# EAGLE design nucleum (EAGLE 6.6.0)
AUTHOR: Joshua Adkins; REV: A; TITLE: Nucleum

## Sheet 1 of 5
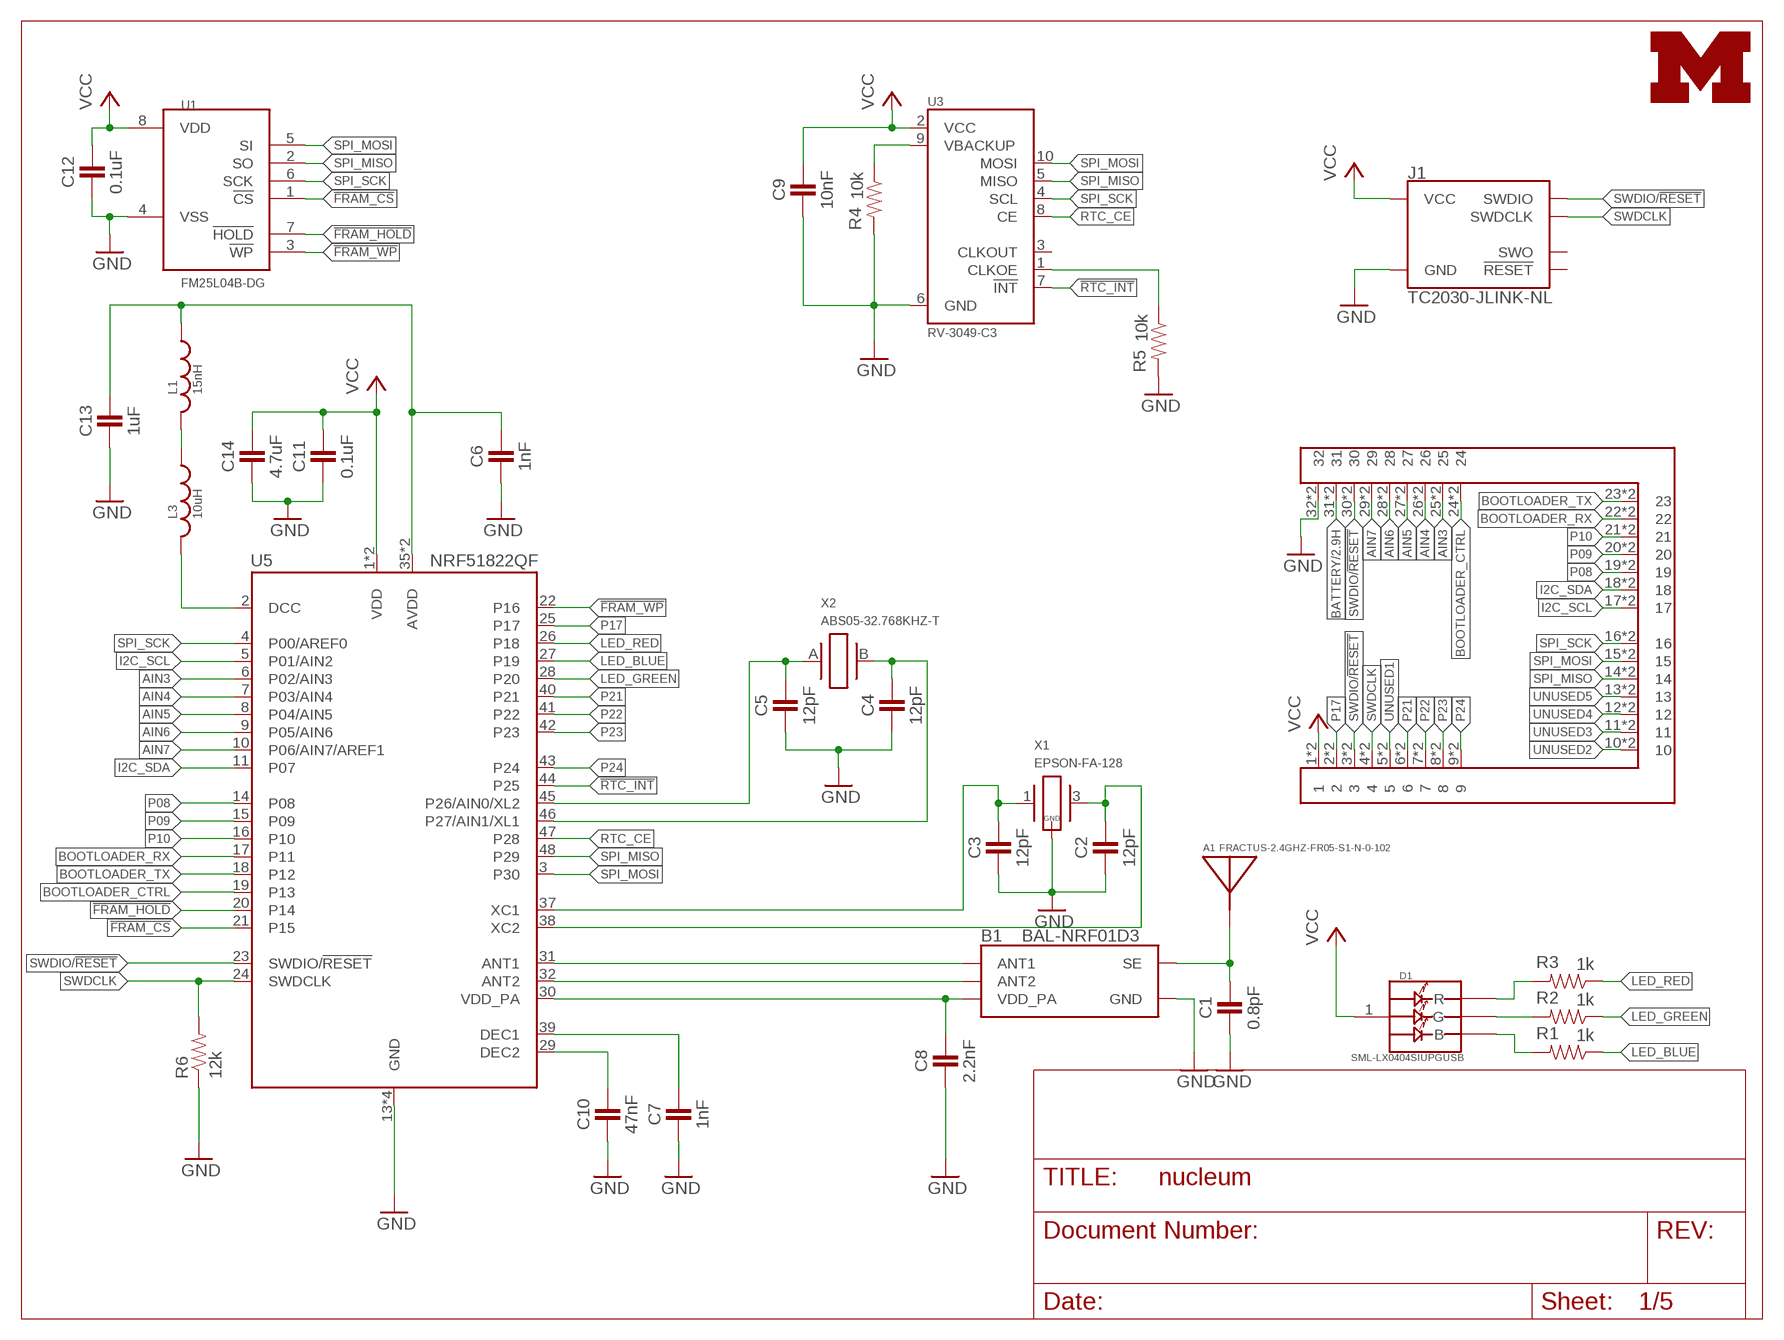
[diagram p0: schematic, sheet 1]

### Parts
A1  FRACTUS-2.4GHZ-FR05-S1-N-0-102  [FRACTUS-ANTENNA-FR05-S1-N-0-102]
B1  BAL-NRF01D3  [BAL-NRF01D3]
C1  0.8pF  CAPACITOR  [0402_CAP]
C2  12pF  CAPACITOR  [0402_CAP]
C3  12pF  CAPACITOR  [0402_CAP]
C4  12pF  CAPACITOR  [0402_CAP]
C5  12pF  CAPACITOR  [0402_CAP]
C6  1nF  CAPACITOR  [0402_CAP]
C7  1nF  CAPACITOR  [0402_CAP]
C8  2.2nF  CAPACITOR  [0402_CAP]
C9  10nF  CAPACITOR  [0402_CAP]
C10  47nF  CAPACITOR  [0402_CAP]
C11  0.1uF  CAPACITOR  [0402_CAP]
C12  0.1uF  CAPACITOR  [0402_CAP]
C13  1uF  CAPACITOR  [0402_CAP]
C14  4.7uF  CAPACITOR  [0402_CAP]
D1  SML-LX0404SIUPGUSB  [1MM_SQ_4PAD]
J1  TC2030-JLINK-NL  [TC2030-IDC-NL]
J3  ATUM-HEADER  [ATUM-HEADER]
L1  15nH  INDUCTOR0402  [0402_CAP]
L3  10uH  INDUCTOR0603  [0603_CAP]
LOGO1  UMICH_SOLID_TINY  [UMICH_SOLID_50MIL]
R1  1k  RESISTOR0402_RES  [0402_RES]
R2  1k  RESISTOR0402_RES  [0402_RES]
R3  1k  RESISTOR0402_RES  [0402_RES]
R4  10k  RESISTOR0402_RES  [0402_RES]
R5  10k  RESISTOR0402_RES  [0402_RES]
R6  12k  RESISTOR0402_RES  [0402_RES]
U1  FM25L04B-DG  [TDFN-8]
U3  RV-3049-C3  [MICRO-CRYSTAL-C3]
U5  NRF51822QF  [QFN-48-6MM]
X1  EPSON-FA-128  [FA-128]
X2  ABS05-32.768KHZ-T  [ABS05]

### Nets
!FRAM_CS: U1.1(!CS) U5.21(P15)
!FRAM_HOLD: U1.7(!HOLD) U5.20(P14)
!FRAM_WP: U1.3(!WP) U5.22(P16)
!RTC_INT: U3.7(!INT) U5.44(P25)
AIN3: J3.25 J3.25B U5.6(P02/AIN3)
AIN4: J3.26 J3.26B U5.7(P03/AIN4)
AIN5: J3.27 J3.27B U5.8(P04/AIN5)
AIN6: J3.28 J3.28B U5.9(P05/AIN6)
AIN7: J3.29 J3.29B U5.10(P06/AIN7/AREF1)
ANTENNA: A1.1(ANTENNA) B1.SE C1.1
BATTERY: J3.31 J3.31B ; also sheet 2
BOOTLOADER_CTRL: J3.24 J3.24B U5.19(P13)
BOOTLOADER_RX: J3.22 J3.22B U5.17(P11)
BOOTLOADER_TX: J3.23 J3.23B U5.18(P12)
GND: B1.GND C1.2 C2.2 C3.2 C4.2 C5.2 C6.2 C7.2 C8.2 C9.2 C10.2 C11.2 C12.2 C13.2 C14.2 J1.5(GND) J3.32 J3.32B R4.2 R5.2 R6.1 U1.4(VSS) U3.6(GND) U5.13(GND) U5.33(GND) U5.34(GND) U5.GND X1.2(GND) X1.4(GND) ; also sheet 2,3,4
I2C_SCL: J3.17 J3.17B U5.5(P01/AIN2)
I2C_SDA: J3.18 J3.18B U5.11(P07)
LED_BLUE: R1.1 U5.27(P19)
LED_GREEN: R2.1 U5.28(P20)
LED_RED: R3.1 U5.26(P18)
N$6: C5.1 U5.45(P26/AIN0/XL2) X2.A
N$7: D1.2(R) R3.2
N$9: C3.1 U5.37(XC1) X1.1
N$10: C2.1 U5.38(XC2) X1.3
N$11: D1.4(G) R2.2
N$12: D1.3(B) R1.2
N$13: C4.1 U5.46(P27/AIN1/XL1) X2.B
N$14: R4.1 U3.9(VBACKUP)
N$15: C10.1 U5.29(DEC2)
N$16: R5.1 U3.1(CLKOE)
N$17: C7.1 U5.39(DEC1)
N$18: B1.ANT1 U5.31(ANT1)
N$19: B1.ANT2 U5.32(ANT2)
N$20: B1.VCC(VDD_PA) C8.1 U5.30(VDD_PA)
N$36: C6.1 C13.1 L1.1 U5.35(AVDD) U5.36(AVDD)
N$37: L1.2 L3.1
N$38: L3.2 U5.2(DCC)
P08: J3.19 J3.19B U5.14(P08)
P09: J3.20 J3.20B U5.15(P09)
P10: J3.21 J3.21B U5.16(P10)
P17: J3.2 J3.2B U5.25(P17)
P21: J3.6 J3.6B U5.40(P21)
P22: J3.7 J3.7B U5.41(P22)
P23: J3.8 J3.8B U5.42(P23)
P24: J3.9 J3.9B U5.43(P24)
RTC_CE: U3.8(CE) U5.47(P28)
SPI_MISO: J3.14 J3.14B U1.2(SO) U3.5(MISO) U5.48(P29)
SPI_MOSI: J3.15 J3.15B U1.5(SI) U3.10(MOSI) U5.3(P30)
SPI_SCK: J3.16 J3.16B U1.6(SCK) U3.4(SCL) U5.4(P00/AREF0)
SWDCLK: J1.4(SWDCLK) J3.4 J3.4B R6.2 U5.24(SWDCLK)
SWDIO/!RESET: J1.2(SWDIO) J3.3 J3.3B J3.30 J3.30B U5.23(SWDIO/!RESET)
UNUSED1: J3.5 J3.5B
UNUSED2: J3.10 J3.10B
UNUSED3: J3.11 J3.11B
UNUSED4: J3.12 J3.12B
UNUSED5: J3.13 J3.13B
VCC: C9.1 C11.1 C12.1 C14.1 D1.1(VDD) J1.1(VCC) J3.1 J3.1B U1.8(VDD) U3.2(VCC) U5.1(VDD) U5.12(VDD) ; also sheet 2,4
Unconnected: J1.3(!RESET) J1.6(SWO) U3.3(CLKOUT)

## Sheet 2 of 5
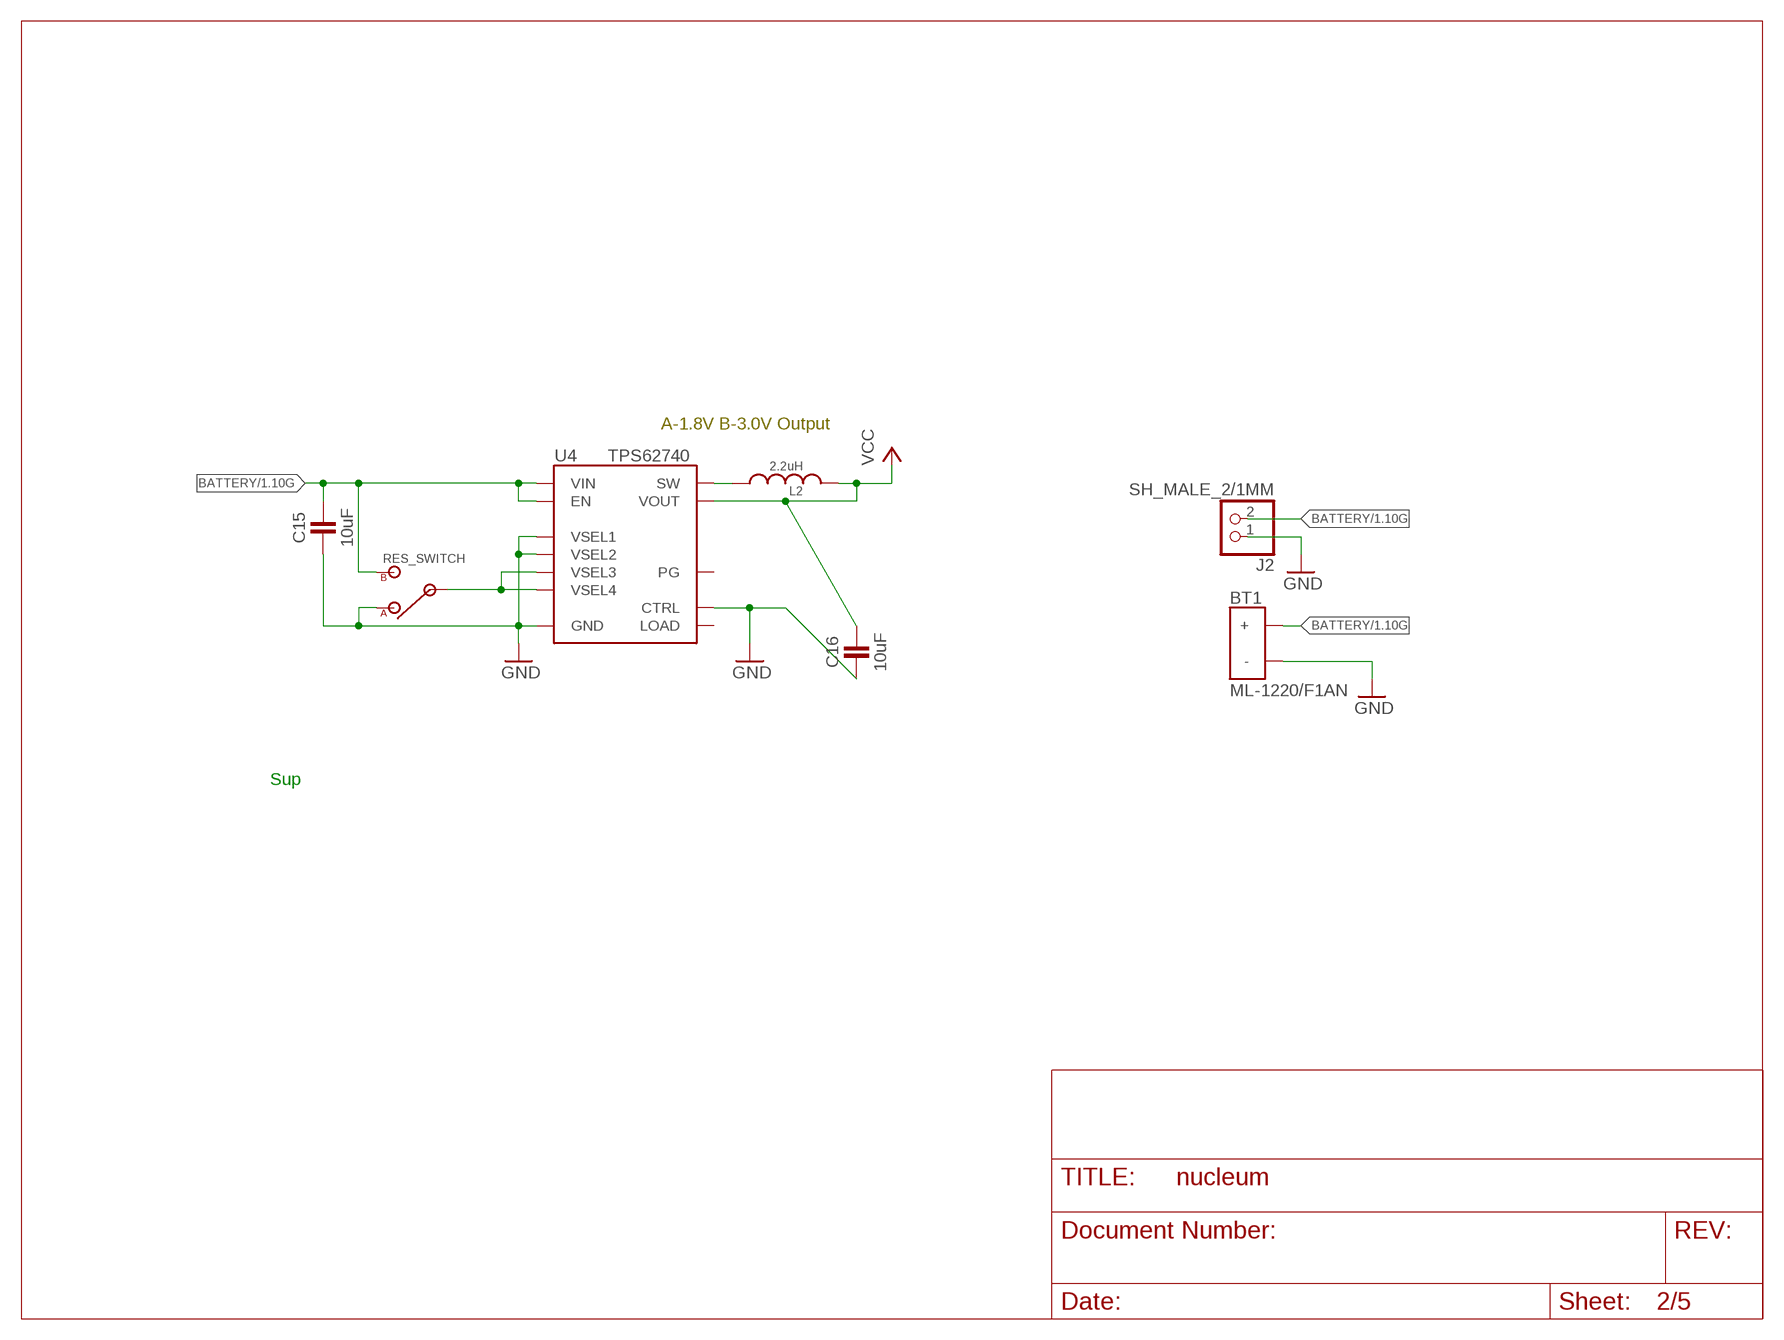
[diagram p1: schematic, sheet 2]

### Parts
BT1  ML-1220/F1AN  [ML-1220/F1BN]
C15  10uF  CAPACITOR0603_CAP  [0603_CAP]
C16  10uF  CAPACITOR0603_CAP  [0603_CAP]
J2  SH_MALE_2/1MM  [SH-1X2/1MM]
L2  2.2uH  MIPSZ2012D  [MIPSZ201D]
S1  RES_SWITCH  [RES_SWITCH]
U4  TPS62740  [R-PWSON-12]

### Nets
BATTERY: BT1.POS(+) C15.1 J2.2 S1.B U4.1(VIN) U4.12(EN) ; also sheet 1
GND: BT1.NEG(-) C15.2 C16.2 J2.1 S1.A U4.3(GND) U4.4(CTRL) U4.10(VSEL2) U4.11(VSEL1) U4.NC(GND) ; also sheet 1,3,4
N$5: L2.1 U4.2(SW)
N$8: S1.C(IN) U4.8(VSEL4) U4.9(VSEL3)
VCC: C16.1 L2.2 U4.5(VOUT) ; also sheet 1,4
Unconnected: U4.6(LOAD) U4.7(PG)

### Notes on the sheet
- A-1.8V B-3.0V Output
- Sup

## Sheet 3 of 5
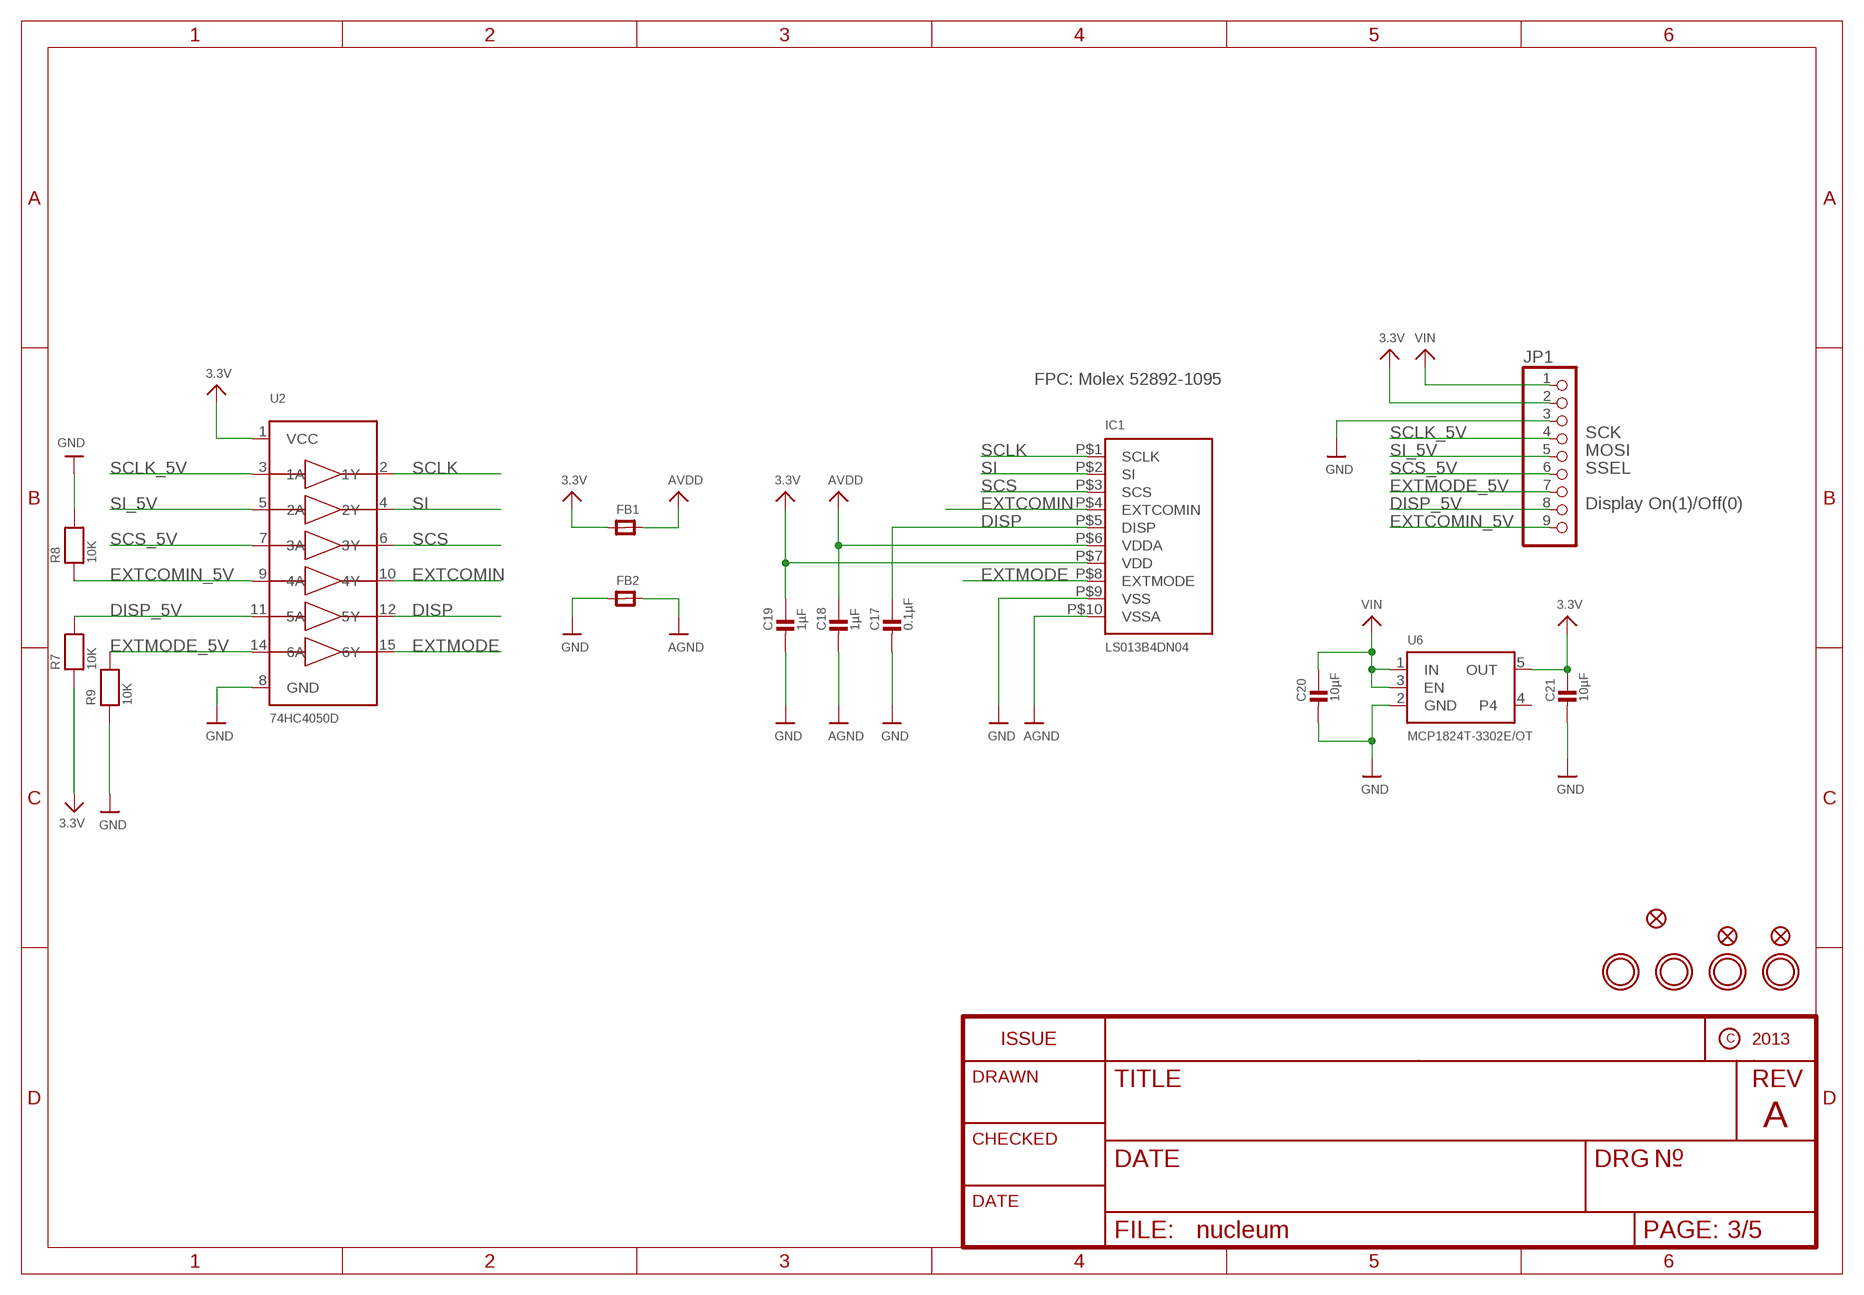
[diagram p2: schematic, sheet 3]

### Parts
C17  0.1µF  CAP_CERAMIC_0805  [_0805]
C18  1µF  CAP_CERAMIC_0805  [_0805]
C19  1µF  CAP_CERAMIC_0805  [_0805]
C20  10µF  CAP_CERAMIC_0805  [_0805]
C21  10µF  CAP_CERAMIC_0805  [_0805]
FB1  FERRITE_0805  [_0805]
FB2  FERRITE_0805  [_0805]
FID1  FIDUCIAL""  [FIDUCIAL_1MM]
FID2  FIDUCIAL""  [FIDUCIAL_1MM]
FID3  FIDUCIAL""  [FIDUCIAL_1MM]
IC1  LS013B4DN04  SHARP_MEMORYLCD_10PIN  [FPC_10PIN_52892-1095]
JP1  HEADER-1X970MIL  [1X09_ROUND_70]
R7  10K  RESISTOR_0805  [_0805]
R8  10K  RESISTOR_0805  [_0805]
R9  10K  RESISTOR_0805  [_0805]
U2  74HC4050D  [SOIC16]
U6  MCP1824T-3302E/OT  VREG_SOT23-5  [SOT23-5]
U$21  MOUNTINGHOLE3.0THIN  [MOUNTINGHOLE_3.0_PLATEDTHIN]
U$22  MOUNTINGHOLE3.0THIN  [MOUNTINGHOLE_3.0_PLATEDTHIN]
U$27  MOUNTINGHOLE3.0THIN  [MOUNTINGHOLE_3.0_PLATEDTHIN]
U$28  MOUNTINGHOLE3.0THIN  [MOUNTINGHOLE_3.0_PLATEDTHIN]

### Nets
3.3V: C19.1 C21.1 FB1.1 IC1.P$7(VDD) JP1.2 R7.1 U2.1(VCC) U6.5(OUT)
AGND: C18.2 FB2.2 IC1.P$10(VSSA)
AVDD: C18.1 FB1.2 IC1.P$6(VDDA)
DISP: C17.1 IC1.P$5(DISP) U2.12(5Y)
DISP_5V: JP1.8 R7.2 U2.11(5A)
EXTCOMIN: IC1.P$4(EXTCOMIN) U2.10(4Y)
EXTCOMIN_5V: JP1.9 R8.1 U2.9(4A)
EXTMODE: IC1.P$8(EXTMODE) U2.15(6Y)
EXTMODE_5V: JP1.7 R9.2 U2.14(6A)
GND: C17.2 C19.2 C20.2 C21.2 FB2.1 IC1.P$9(VSS) JP1.3 R8.2 R9.1 U2.8(GND) U6.2(GND) ; also sheet 1,2,4
SCLK: IC1.P$1(SCLK) U2.2(1Y)
SCLK_5V: JP1.4 U2.3(1A)
SCS: IC1.P$3(SCS) U2.6(3Y)
SCS_5V: JP1.6 U2.7(3A)
SI: IC1.P$2(SI) U2.4(2Y)
SI_5V: JP1.5 U2.5(2A)
VIN: C20.1 JP1.1 U6.1(IN) U6.3(EN)
Unconnected: U6.4

### Notes on the sheet
- FPC: Molex 52892-1095
- SCK
- MOSI
- SSEL
- Display On(1)/Off(0)

## Sheet 4 of 5
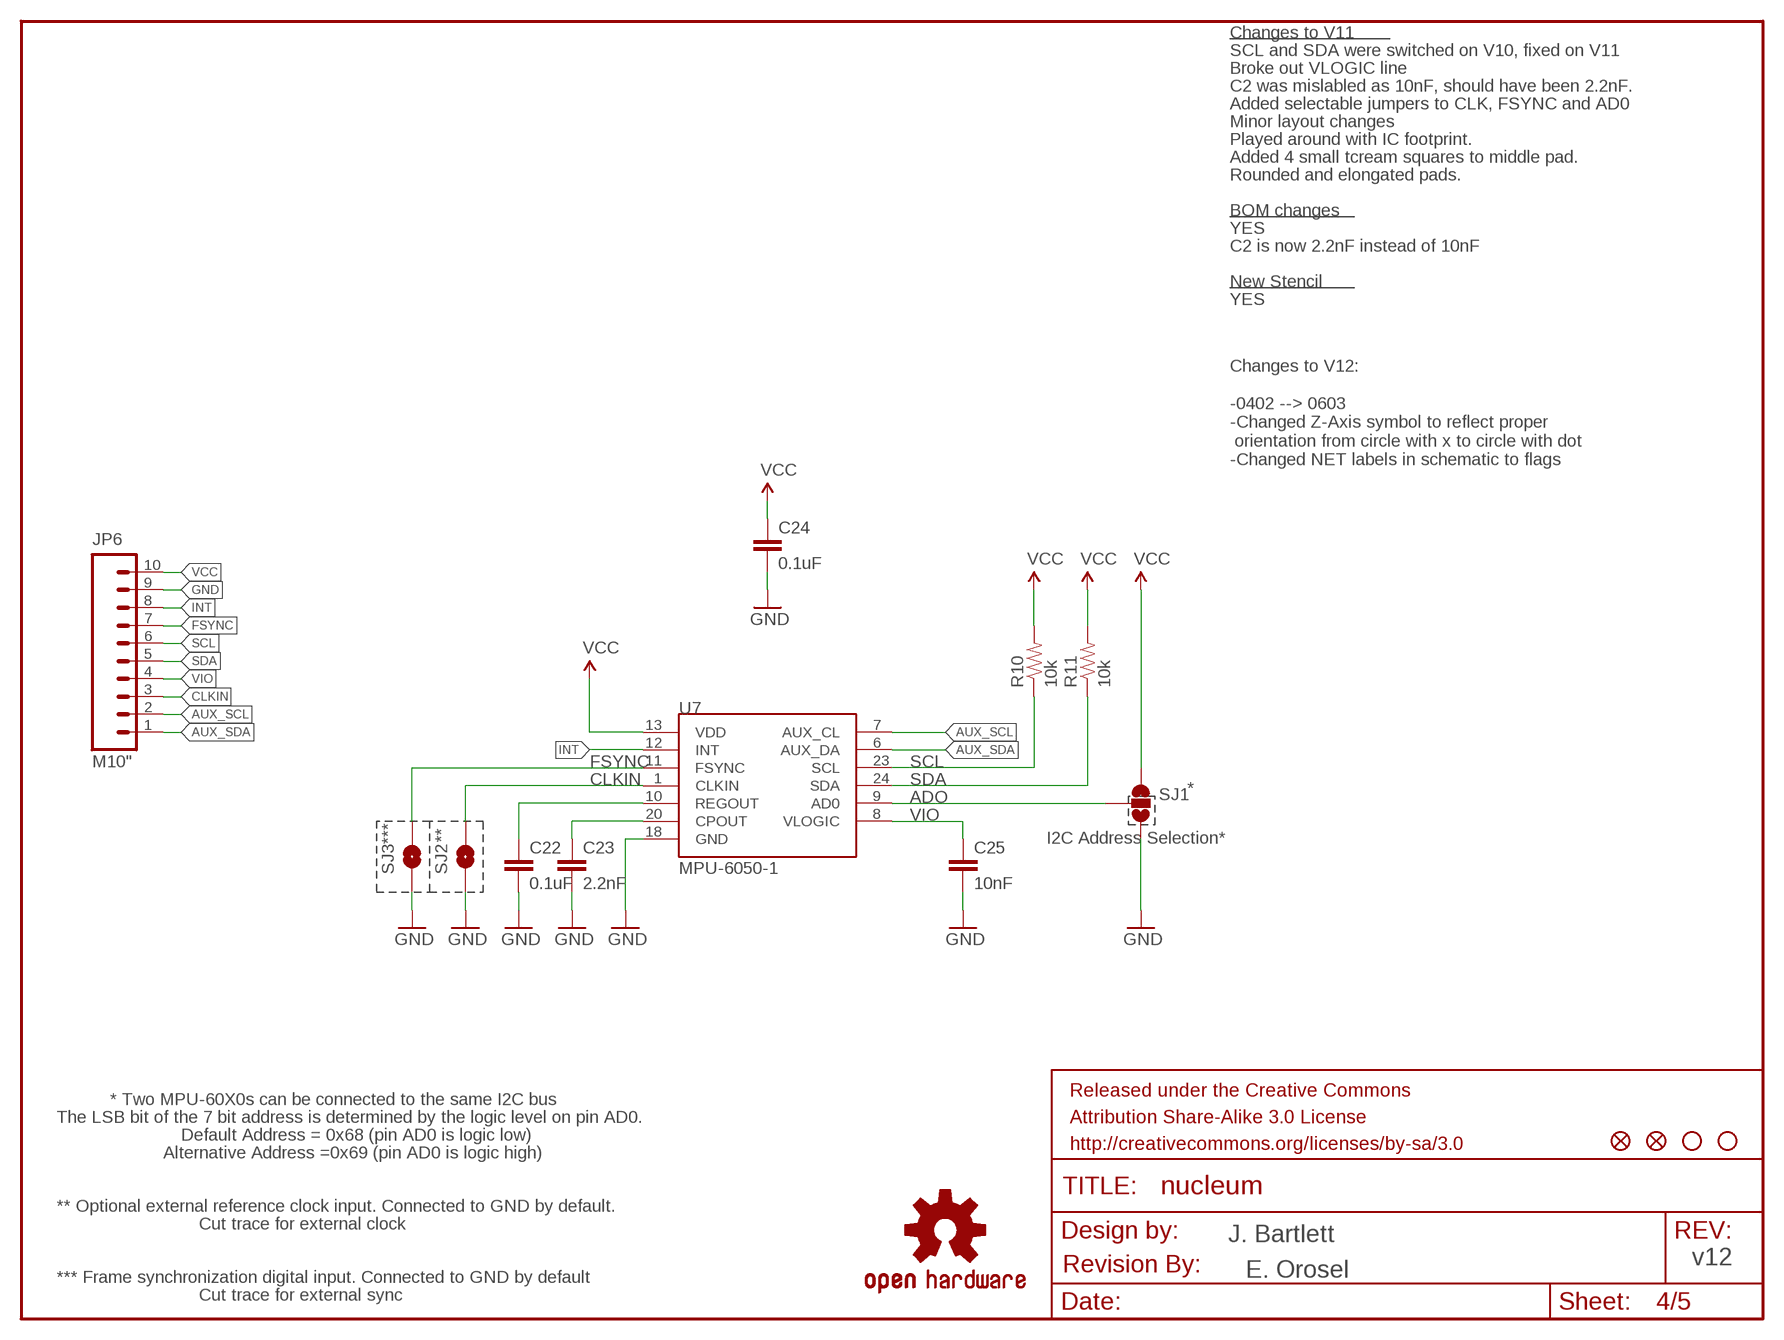
[diagram p3: schematic, sheet 4]

### Parts
C22  0.1uF  CAP0603-CAP  [0603-CAP]
C23  2.2nF  CAP0603-CAP  [0603-CAP]
C24  0.1uF  CAP0603-CAP  [0603-CAP]
C25  10nF  CAP0603-CAP  [0603-CAP]
FRAME4  FRAME-LETTER  [CREATIVE_COMMONS]
JP2  FIDUCIALUFIDUCIAL  [MICRO-FIDUCIAL]
JP3  STAND-OFFTIGHT  [STAND-OFF-TIGHT]
JP4  STAND-OFFTIGHT  [STAND-OFF-TIGHT]
JP5  FIDUCIALUFIDUCIAL  [MICRO-FIDUCIAL]
JP6  M10"  [1X10]
R10  10k  RESISTOR0603-RES  [0603-RES]
R11  10k  RESISTOR0603-RES  [0603-RES]
SJ1  SOLDERJUMPER_2WAYPASTE2&3  [SJ_3_PASTE2&3]
SJ2  SOLDERJUMPERTRACE  [SJ_2S-TRACE]
SJ3  SOLDERJUMPERTRACE  [SJ_2S-TRACE]
U7  MPU-6050-1  [QFN-24-4MM2]
U$30  OSHW-LOGOS  [OSHW-LOGO-S]
U$31  REVISION  [REVISION]

### Nets
ADO: SJ1.2 U7.9(AD0)
AUX_SCL: JP6.2 U7.7(AUX_CL)
AUX_SDA: JP6.1 U7.6(AUX_DA)
CLKIN: JP6.3 SJ2.2 U7.1(CLKIN)
FSYNC: JP6.7 SJ3.2 U7.11(FSYNC)
GND: C22.2 C23.2 C24.2 C25.2 JP6.9 SJ1.3 SJ2.1 SJ3.1 U7.18(GND) ; also sheet 1,2,3
INT: JP6.8 U7.12(INT)
N$1: C23.1 U7.20(CPOUT)
N$21: C22.1 U7.10(REGOUT)
SCL: JP6.6 R10.1 U7.23(SCL)
SDA: JP6.5 R11.1 U7.24(SDA)
VCC: C24.1 JP6.10 R10.2 R11.2 SJ1.1 U7.13(VDD) ; also sheet 1,2
VIO: C25.1 JP6.4 U7.8(VLOGIC)

### Notes on the sheet
- Changes to V11
- SCL and SDA were switched on V10, fixed on V11
- Broke out VLOGIC line
- C2 was mislabled as 10nF, should have been 2.2nF.
- Added selectable jumpers to CLK, FSYNC and AD0
- Minor layout changes
- Played around with IC footprint.
- Added 4 small tcream squares to middle pad.
- Rounded and elongated pads.
- BOM changes
- YES
- C2 is now 2.2nF instead of 10nF
- New Stencil
- YES
- Changes to V12:
  
  -0402 --> 0603
  -Changed Z-Axis symbol to reflect proper
   orientation from circle with x to circle with dot
  -Changed NET labels in schematic to flags
- *
- *** | ** | I2C Address Selection*
- * Two MPU-60X0s can be connected to the same I2C bus
- The LSB bit of the 7 bit address is determined by the logic level on pin AD0.
- Default Address = 0x68 (pin AD0 is logic low)
- Alternative Address =0x69 (pin AD0 is logic high)
- ** Optional external reference clock input. Connected to GND by default.
- Cut trace for external clock
- J. Bartlett
- v12
- E. Orosel
- *** Frame synchronization digital input. Connected to GND by default
- Cut trace for external sync

## Sheet 5 of 5

## Library data of the parts
A1 = chips:FRACTUS-2.4GHZ-FR05-S1-N-0-102: Fractus Compact Reach XtendTM chip antenna is engineered specifically for Bluetooth, WLAN 802.11 b/g/n and other wireless devices operating at the ISM 2.4 GHz band. Compact Reach Xtend combines small form factor size and high performance to improve the functionality of your wireless devices.; RICHARDSON_RFPD: FR05-S1-N-0102B
B1 = chips:BAL-NRF01D3: 50 ohm nominal input / conjugate match balun to nRF51422-QFAA, nRF24LE1, nRF51822-QFAA/AB, with integrated harmonic filter; DIGIKEY: 497-13637-1-ND; MOUSER: 511-BAL-NRF01D3
BT1 = batteries:ML-1220/F1AN: BATTERY LITH 3V RECHARGE PC PINS; DIGIKEY: P663-nd; MOUSER: 658-ML-1220/F1BN
C1-C14 = passives:CAPACITOR: 0402 Capacitor
C15 C16 = passives:CAPACITOR: 0402 Capacitor; DIGIKEY: 490-7316-1-ND
C17-C21 = microbuilder:CAP_CERAMIC: Ceramic Capacitors For new designs, use the packages preceded by an '_' character since they are more reliable: The following footprints should be used on most boards: _0402 - Standard footprint for regular board layouts _0603 - Standard footprint for regular board layouts _0805 - Standard footprint for regular board layouts For extremely tight-pitch boards where space is at a premium, the following 'micro-pitch' footprints can be used (smaller pads, no silkscreen outline, etc.): _0402MP - Micro-pitch footprint for very dense/compact boards _0603MP - Micro-pitch footprint for very dense/compact boards _0805MP - Micro-pitch footprint for very dense/compact boards Commonly Stocked Parts 0402 - 0402 Surface Mount Capacitors 16pF 50V 5% [Digikey: 445-4899-2-ND] 18pF 50V 5% [Digikey: 490-1281-2-ND] 22pF 50V 5% [Digikey: 490-1283-2-ND] 68pF 50V 5% [Digikey: 490-1289-2-ND] 0.1uF 10V 10% [Digikey: 490-1318-2-ND] 1.0uF 6.3V 10% [Digikey: 490-1320-2-ND] 0603 - 0603 Surface Mount Capacitors 16 pF 50V 5% [Digikey: 445-5051-2-ND] 22 pF 50V [Digikey: PCC220ACVTR-ND] 33 pF 50V 5% [Digikey: 490-1415-1-ND] 56pF 50V 5% [Digikey: 490-1421-1-ND] 220pF 50V 5% [Digikey: 445-1285-1-ND] 680 pF 50V 2200 pF 50V 5% C0G [Digikey: 445-1297-1-ND] 5600 pF 100V 5% X7R [Digikey: 478-3711-1-ND] 0.1 µF 25V 10% [Digikey: PCC2277TR-ND] 0.22 µF 16V 10% X7R [Digikey: 445-1318-1-ND] 1.0 µF 25V 10% [Digikey: 445-5146-2-ND] 0603 - RF Specific 3pF 250V +/-0.1pF RF [Digikey: 712-1347-1-ND] 18 pF 250V 5% [Digikey: 478-3505-1-ND or 712-1322-1-ND] 56 pF 250V 5% C0G RF [Digikey: 490-4867-1-ND] 68 pF 250V RF [Digikey: 490-4868-1-ND] 0805 - 0805 Surface Mount Capacitors 220 pF 250V 2% RF Ceramic Capacitor [Digikey: 712-1398-1-ND] 1000 pF 50V 2% NP0 Ceramic Capacitor [Digikey: 478-3760-1-ND] 0.1 µF 25V 10% Ceramic Capacitor [Digikey: PCC1828TR-ND] 1.0 µF 16V 10% Ceramic Capacitor[Digikey: 490-1691-2-ND] 10.0 µF 10V 10% Ceramic Capacitor[Digikey: 709-1228-1-ND] 10.0 uF 16V 10% Ceramic Capacitor [Digikey: 478-5165-2-ND] 47 uF 6.3V 20% Ceramic Capacitor [Digikey: 587-1779-1-ND or 399-5506-1-ND] 1206 - 1206 Surface Mount Capacitors 47uF 10V 20% Ceramic Capacitor [Digikey: 490-5528-1-ND or 399-5508-1-ND or 445-6010-1-ND] 100uF 6.3V -20%, +80% Y5V Ceramic Capacitor (Digikey: 490-4512-1-ND, Mouser: 81-GRM31CF50J107ZE1L)
C22-C25 = SparkFun:CAP: Capacitor Standard 0603 ceramic capacitor, and 0.1" leaded capacitor.
D1 = leds:SML-LX0404SIUPGUSB: 1mm^2 RGB LED; DIGIKEY: 67-2125-1-ND
FB1 FB2 = microbuilder:FERRITE: Ferrite Bead 0603 MMZ1608B121C - 120 Ohm @ 100MHz, 600mA, 0.15 Ohm DC Resistance - Digikey: 445-2164-1-ND BK1608HW121-T - 120 Ohm, 600mA Ferrite Chip - Digikey: 587-1876-2-ND 0805 HZ0805B272R-10 - 2.7K Ohm @ 100MHz, 200mA, 0.8 Ohm DC Resistance - Digikey: 240-2504-1-ND (see also Murata BLM21BD272SN1L) MMZ2012Y152B - 1.5K Ohm @ 100MHz, 500mA, 0.4 Ohm DC Resistance - Digikey: 445-1560-1-ND - Mainly for high frequency (80-400MHz) MMZ2012R102A - 1K Ohm @ 100MHz, 500mA, 0.3 Ohm DC Resistance - Digikey: 445-1555-2-ND - More general purpose (10-200MHz)
FID1-FID3 = microbuilder:FIDUCIAL: Fiducial Alignment Points Various fiducial points for machine vision alignment.
FRAME4 = SparkFun-Aesthetics:FRAME-LETTER: Schematic Frame Standard 8.5x11 US Letter frame
IC1 = microbuilder:SHARP_MEMORYLCD_10PIN: Sharp Mono Memory LCD LS013B4DN02 - 1.35" 96x96 Pixels LS027B7DH01 - 2.7" 400x240 Pixels
J1 = connector:TC2030-JLINK
J2 = headers:SH_MALE_2/1MM: 1.0mm pitch/Disconnectable Crimp style connectors; DIGIKEY: 455-1788-2-ND
J3 = atum:ATUM-HEADER: Castellated header for the Atum board.
JP1 = microbuilder:HEADER-1X9: PIN HEADER
JP2 JP5 = SparkFun:FIDUCIAL: Fiducial Alignment Points Various fiducial points for machine vision alignment.
JP3 JP4 = SparkFun:STAND-OFF: Stand Off This is the mechanical footprint for a #4 phillips button head screw. Use the keepout ring to avoid running the screw head into surrounding components. SKU : PRT-00447
JP6 = SparkFun:M10: Header 10 Standard 10-pin 0.1" header. Use with straight break away headers (SKU : PRT-00116), right angle break away headers (PRT-00553), swiss pins (PRT-00743), machine pins (PRT-00117), and female headers (PRT-00115).
L1 L3 = passives:INDUCTOR
L2 = passives:MIPSZ2012D: FDK Multi-layer Power Inductor : MIPSZ2012D series (Very Small Type)
LOGO1 = logos:UMICH_SOLID
R1-R6 = passives:RESISTOR: Resistor Basic schematic elements and footprints for 0603, 1206, and PTH resistors.
R7-R9 = microbuilder:RESISTOR: Resistors For new designs, use the packages preceded by an '_' character since they are more reliable: The following footprints should be used on most boards: _0402 - Standard footprint for regular board layouts _0603 - Standard footprint for regular board layouts _0805 - Standard footprint for regular board layouts For extremely tight-pitch boards where space is at a premium, the following 'micro-pitch' footprints can be used (smaller pads, no silkscreen outline, etc.): _0402MP - Micro-pitch footprint for very dense/compact boards _0603MP - Micro-pitch footprint for very dense/compact boards _0805MP - Micro-pitch footprint for very dense/compact boards
R10 R11 = SparkFun:RESISTOR: Resistor Basic schematic elements and footprints for 0603, 1206, and PTH resistors.
S1 = switches:RES_SWITCH: 0402 Static Resistor Selector
SJ1 = SparkFun:SOLDERJUMPER_2WAY: Solder Jumper 2 way solder jumper
SJ2 SJ3 = SparkFun:SOLDERJUMPER: Solder Jumper Standard SMD solder jumper. Used to automate production. Two varients : Normally Open and Normally Closed are the same, but have different paste layers. NC will have a large amount of paste and should jumper during reflow.
U1 = chips:FM25: Cypress FRAM; DIGIKEY: FM25L04B-DGRA-ND; MOUSER: 877-FM25L04B-DG
U2 = microbuilder:74HC4050D: 6-channel level shifter 74HC4050D - 2V-6V Supply SOIC16 Digikey: 74HC4050D,653-ND Mouser: 771-74HC4050D-T TSSOP16 Digikey: 296-9215-1-ND Mouser:
U3 = chips:RV-3049-C3: The RV-3049-C3 is an ultra miniature Real-Time-Clock Module with embedded Crystal. This RTC has an SPI Bus (4-wire Serial- Interface) and offers temperature compensated time.
U4 = chips:TPS62740: 360nA Step Down Converter for Low Power Applications; DIGIKEY: 296-37134-1-ND; MOUSER: 595-TPS62740DSST; NEWARK: 27X9745
U5 = chips:NRF51822: Multiprotocol Bluetooth® 4.0 low energy/2.4 GHz RF SoC; DIGIKEY: 1490-1032-1-ND; MOUSER: 949-NRF51822-QFAB-R7
U6 = microbuilder:VREG_SOT23-5: SOT23-5 Fixed Voltage Regulators Part Current Out V Out V In V Dropout θJA (°C/W) TJ (°C) Digikey Part No. ADP121 150mA 3.3V 3.4-5.5V 0.09V @ 150mA -- -- ADP121-AUJZ33R7CT-ND ADP121 150mA 3.0V 3.1-5.5V 0.09V @ 150mA -- -- ADP121-AUJZ30R7CT-ND ADP122 300mA 3.3V 3.4-5.5V 0.085V @ 300mA -- -- ADP122AUJZ-3.3-R7CT-ND ADP1712 300mA 3.3V 3.5-5.5V 0.17V @ 300mA -- -- ADP1712AUJZ-3.3-R7TR-ND AP7311 (Low Cost) 150mA 3.3V 3.5-6V 0.15V @ 150mA -- -- AP7311-33WG-7DICT-ND LD39015M18R 150mA 1.8V 1.9V-5.5V 0.08V @ 100mA -- -- 497-6977-1-ND LP2985A-33DBVR 150mA 3.3V 3.3-16V 0.28V @ 150mA 206 150 296-18479-1-ND MCP1824T-3302E/OT 300mA 3.3V 3.5V-6V 0.2V @ 300mA -- -- MCP1824T-3302E/OTCT-ND MIC5205-2.5YM5 TR 150mA 2.5V 2.7-16V 0.165V @ 150mA -- -- 576-1257-2-ND MIC5205-3.0YM5 TR 150mA 3.0V 3.2V-16V 0.165V @ 150mA -- -- 576-1258-2-ND MIC5205-3.3YM5 TR 150mA 3.3V 3.5V-16V 0.165V @ 150mA -- -- 576-1259-2-ND TPS780330220 150mA 3.3V+2.2V 3.6-5.5V 250mV Max -- -- 296-23332-1-ND TDA3663/N1,135 100mA 3.3V 3.5-45V 0.18V @ 50mA -- -- 568-5343-1-ND Max operating temp can be calculated using θJA, TJ (max junction temperature), and power in watts. Set the "Maximum Ambient Temperature" until it reaches TJ ("Max Junction Temperature"), which is the absolute limit for safe use of the regulator: Heat Sink Temperature Calculator <http://www.daycounter.com/Calculators/Heat-Sink-Temperature-Calculator.phtml> For example, With 12V source into a 3.3V LP2985 and a 30mA load, we are dissipating (12V-3.3V) * 0.03A = 0.261W. With a θJA of 206 °C/W, a TJ of 150°C, and 261mW we can safely use the chip without a heat sink up to 75°C (=147.1°C Junction Temperature).
U7 = Testing:MPU-6050
U$21 U$22 U$27 U$28 = microbuilder:MOUNTINGHOLE: Mounting Hole For #2 screws (0.086"/2.18mm width, 0.094"/2.4mm hole) use 2.5mm
U$30 = SparkFun:OSHW-LOGO: Open Source Hardware Logo This logo indicates the piece of hardware it is found on incorporates a OSHW license and/or adheres to the definition of open source hardware found here: http://freedomdefined.org/OSHW
U$31 = SparkFun-Aesthetics:REVISION
X1 = crystals:EPSON-FA-128: MHz RANGE CRYSTAL UNIT ULTRA MINIATURE SIZE LOW PROFILE SMD http://www.digikey.com/product-search/en?FV=ffec63d1
X2 = crystals:ABS05-32.768KHZ: 32.768kHz Crystal; DIGIKEY: 535-11899-1-ND

## Board
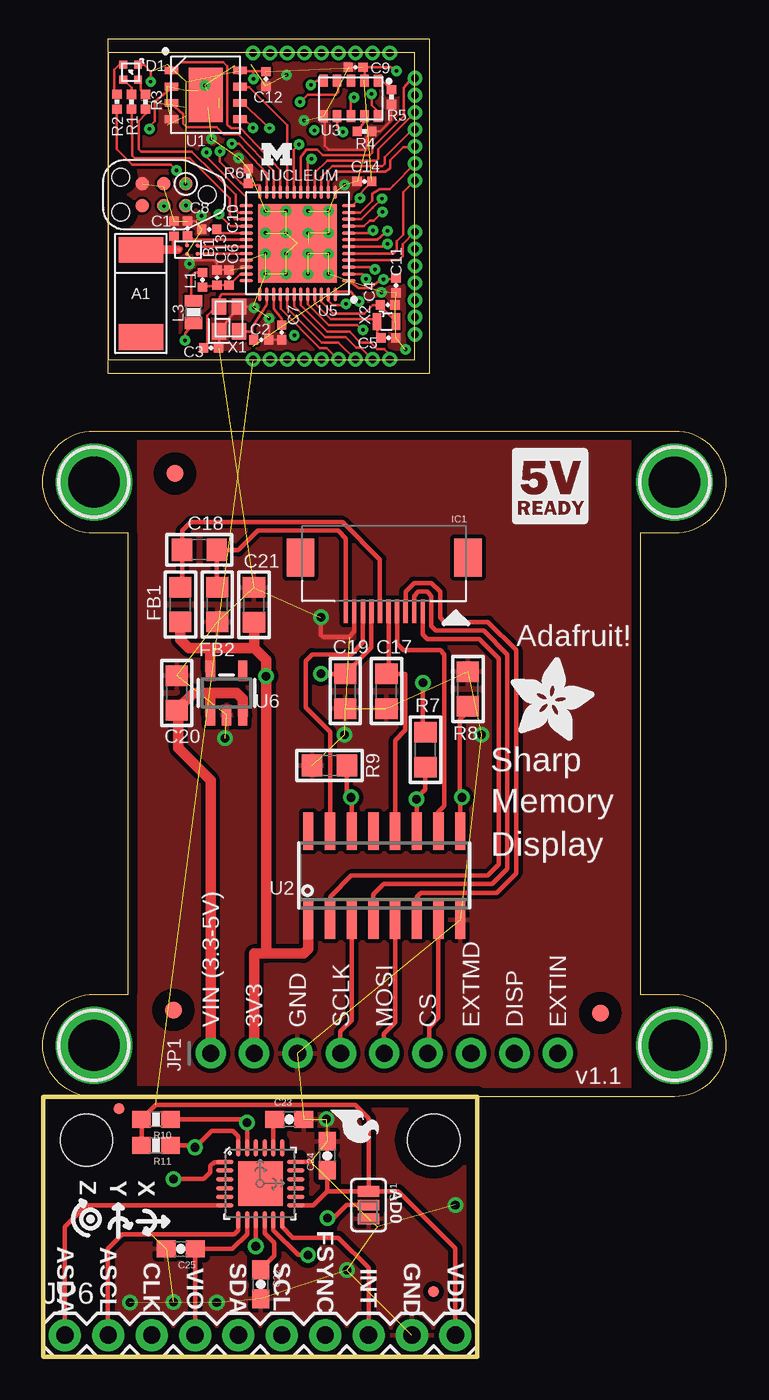
[diagram p4: board, top side]
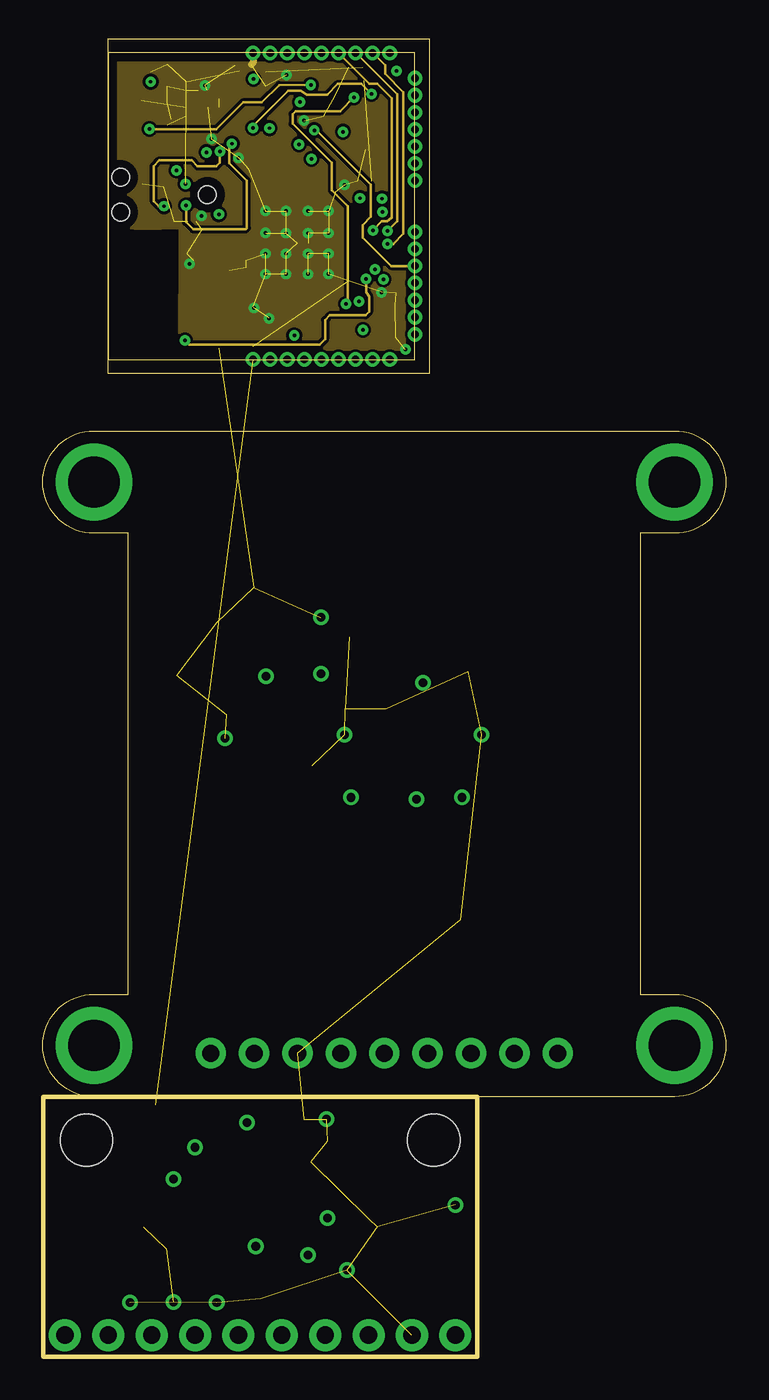
[diagram p5: board, inner layer Route2]
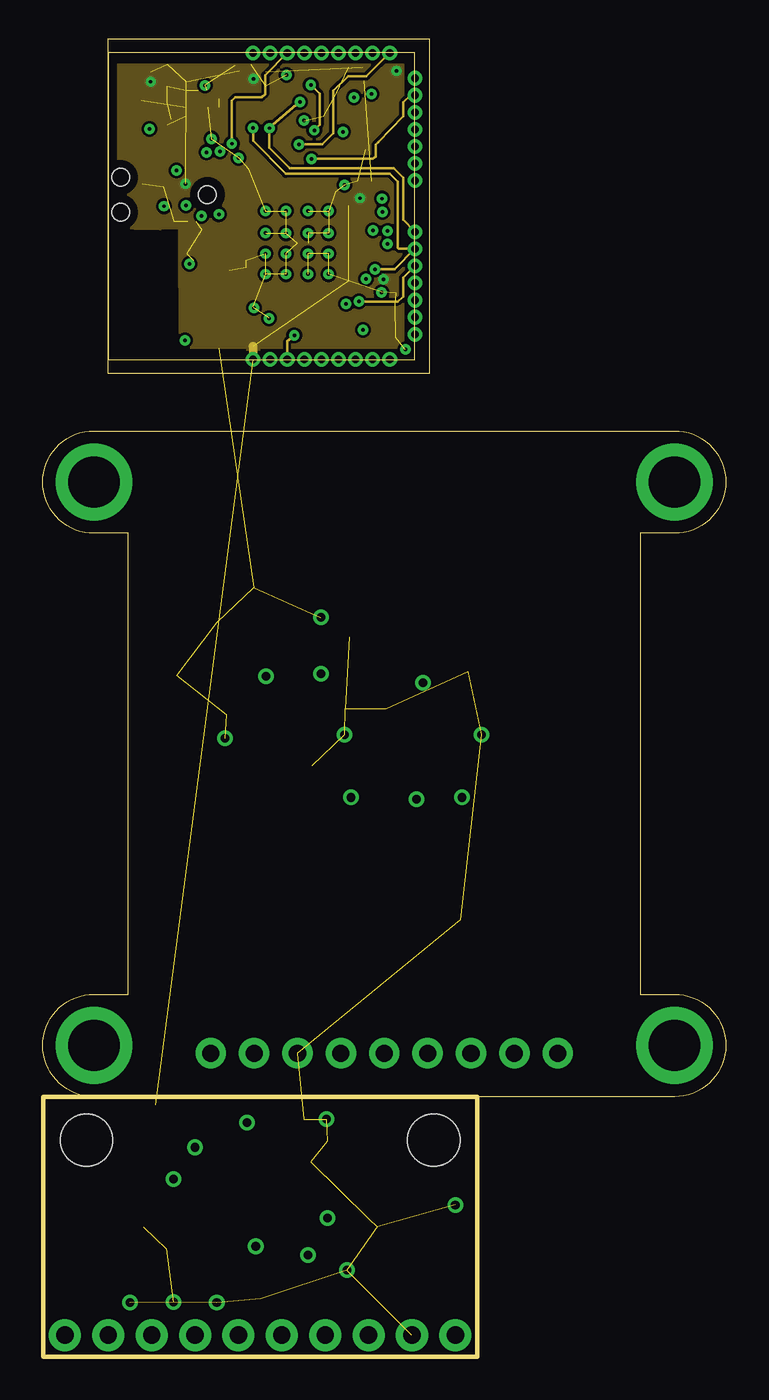
[diagram p6: board, inner layer Route15]
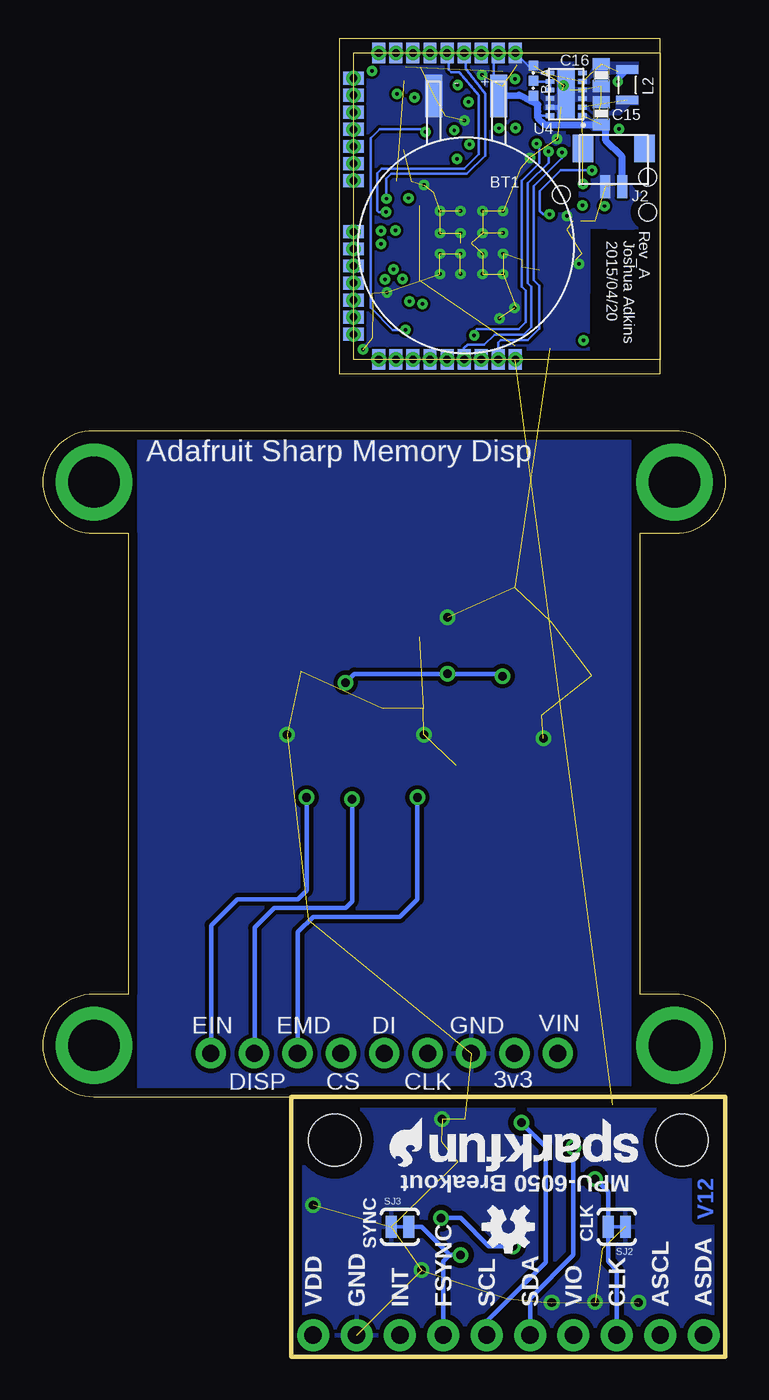
[diagram p7: board, bottom side, seen from below]

Size 40 x 76.38 mm. Coordinates in mm from the lower left corner, seen from the top.
Outline: 3.84,58.42 21.8,58.42 21.8,76.38 3.84,76.38 3.84,58.42
Outline: 0,18.24 arc-90 3,21.24 5,21.24 5,48.24 3,48.24 arc-90 0,51.24 arc-90 3,54.24 37,54.24 arc-90 40,51.24 arc-90 37,48.24 35,48.24 35,21.24 37,21.24 arc-90 40,18.24 arc-90 37,15.24 3,15.24 arc-90 0,18.24
Outline: 25.43,0 25.43,15.24 0.03,15.24 0.03,0 25.43,0
Copper layers (1+2*15+16): Top 0.0178mm / dielectric 12mil / Route2 0.0356mm / dielectric 28mil / Route15 0.0356mm / dielectric 12mil / Bottom 0.0178mm
Design rules "sunstone-4lyr_v1.0.0.3 *": minimum track width 6mil, minimum drill 8mil, track to track 6mil, track to pad 6mil, pad to pad 6mil, via to via 6mil, smd to smd 6mil, copper to edge 20mil, drill to drill 16mil, minimum pad ring 8mil, minimum via ring 8mil, stop-mask expansion 3mil, vias tented up to drill 10mil, thermal gap 10mil
tRestrict: area 14.5,11.6 to 15.1,11.8
Milling: 4 lines

### Footprints (pad centres in the part's own frame; a part is rotated, then mirrored left to right if it is on the bottom)
FRACTUS-ANTENNA-FR05-S1-N-0-102 = smd 1.5 x 2.6: 1 -2.55,0; 2 2.55,0
BAL-NRF01D3 = smd 0.22 x 0.22: ANT1 -0.537,-0.25; ANT2 -0.537,0.25; GND 0.069,0.25; SE 0.537,0; VCC 0.069,-0.25
ML-1220/F1BN = smd 2.5 x 1: NEG 8.75,1.9; POS 8.75,-1.9
0402_CAP = smd 0.536 x 0.546: 1 -0.433,0; 2 0.433,0
0603_CAP = smd 0.7 x 1: 1 -0.65,0; 2 0.65,0
_0805 = smd 1.2 x 1.3: 1 -1.016,0; 2 1.016,0
0603-CAP = smd 1.1 x 1: 1 -0.85,0; 2 0.85,0
1MM_SQ_4PAD = smd 0.457 x 0.457: 1 0.432,0.432; 2 0.432,-0.432; 3 -0.432,-0.432; 4 -0.432,0.432
FIDUCIAL_1MM = smd 1 x 1: 1 0,0
FPC_10PIN_52892-1095 = smd 0.25 x 1.4: P$1 -2.25,0; P$2 -1.75,0; P$3 -1.25,0; P$4 -0.75,0; P$5 -0.25,0; P$6 0.25,0; P$7 0.75,0; P$8 1.25,0; P$9 1.75,0; P$10 2.25,0 | smd 1.6 x 2.2: SUPPORT1 -4.9,-3.15; SUPPORT2 4.9,-3.15
TC2030-IDC-NL = smd 0.787 x 0.787: 1 -1.27,-0.635; 2 -1.27,0.635; 3 0,-0.635; 4 0,0.635; 5 1.27,-0.635; 6 1.27,0.635 | hole 1.016: -2.54,0; 2.54,1.016; 2.54,-1.016
SH-1X2/1MM = smd 0.6 x 1.35: 1 -0.5,0.1; 2 0.5,0.1 | smd 1.2 x 1.6: SUPPORT1 -1.8,2.335; SUPPORT2 1.8,2.335
ATUM-HEADER = drill 0.45 pad 0.754: 1 -9.479,-8.979; 2 -8.479,-8.979; 3 -7.479,-8.979; 4 -6.479,-8.979; 5 -5.479,-8.979; 6 -4.479,-8.979; 7 -3.479,-8.979; 8 -2.479,-8.979; 9 -1.479,-8.979; 10 0,-7.5; 11 0,-6.5; 12 0,-5.5; 13 0,-4.5; 14 0,-3.5; 15 0,-2.5; 16 0,-1.5; 17 0,1.5; 18 0,2.5; 19 0,3.5; 20 0,4.5; 21 0,5.5; 22 0,6.5; 23 0,7.5; 24 -1.479,8.979; 25 -2.479,8.979; 26 -3.479,8.979; 27 -4.479,8.979; 28 -5.479,8.979; 29 -6.479,8.979; 30 -7.479,8.979; 31 -8.479,8.979; 32 -9.479,8.979 | smd 0.754 x 1.2 bottom: 1B -9.479,-8.979; 2B -8.479,-8.979; 3B -7.479,-8.979; 4B -6.479,-8.979; 5B -5.479,-8.979; 6B -4.479,-8.979; 7B -3.479,-8.979; 8B -2.479,-8.979; 9B -1.479,-8.979; 24B -1.479,8.979; 25B -2.479,8.979; 26B -3.479,8.979; 27B -4.479,8.979; 28B -5.479,8.979; 29B -6.479,8.979; 30B -7.479,8.979; 31B -8.479,8.979; 32B -9.479,8.979 | smd 1.2 x 0.754 bottom: 10B 0,-7.5; 11B 0,-6.5; 12B 0,-5.5; 13B 0,-4.5; 14B 0,-3.5; 15B 0,-2.5; 16B 0,-1.5; 17B 0,1.5; 18B 0,2.5; 19B 0,3.5; 20B 0,4.5; 21B 0,5.5; 22B 0,6.5; 23B 0,7.5
1X09_ROUND_70 = drill 1 pad 1.778: 1 -10.16,0; 2 -7.62,0; 3 -5.08,0; 4 -2.54,0; 5 0,0; 6 2.54,0; 7 5.08,0; 8 7.62,0; 9 10.16,0
MICRO-FIDUCIAL = smd 0.635 x 0.635: 1 0,0
STAND-OFF-TIGHT = hole 3.048: 0,0
1X10 = drill 1.016 pad 1.88: 1 0,0; 2 2.54,0; 3 5.08,0; 4 7.62,0; 5 10.16,0; 6 12.7,0; 7 15.24,0; 8 17.78,0; 9 20.32,0; 10 22.86,0
MIPSZ201D = smd 0.5 x 1.3: 1 -0.9,0; 2 0.9,0
0402_RES = smd 0.536 x 0.546: 1 -0.433,0; 2 0.433,0
0603-RES = smd 1.1 x 1: 1 -0.85,0; 2 0.85,0
RES_SWITCH = smd 0.56 x 0.56: A -0.88,0; B 0.88,0; C 0,0
SJ_3_PASTE2&3 = smd 0.635 x 1.27: 1 -0.813,0; 2 0,0; 3 0.813,0
SJ_2S-TRACE = smd 0.635 x 1.27: 1 -0.508,0; 2 0.508,0
TDFN-8 = smd 0.45 x 0.8: 1 -1.425,-2.007; 2 -0.475,-2.007; 3 0.475,-2.007; 4 1.425,-2.007; 5 1.425,2.007; 6 0.475,2.007; 7 -0.475,2.007; 8 -1.425,2.007 | smd 3.2 x 2: NC 0,0
SOIC16 = smd 0.6 x 2.2: 1 -4.445,-2.6; 2 -3.175,-2.6; 3 -1.905,-2.6; 4 -0.635,-2.6; 5 0.635,-2.6; 6 1.905,-2.6; 7 3.175,-2.6; 8 4.445,-2.6; 9 4.445,2.6; 10 3.175,2.6; 11 1.905,2.6; 12 0.635,2.6; 13 -0.635,2.6; 14 -1.905,2.6; 15 -3.175,2.6; 16 -4.445,2.6
MICRO-CRYSTAL-C3 = smd 0.5 x 0.7: 1 -1.6,-1.05; 2 -0.8,-1.05; 3 0,-1.05; 4 0.8,-1.05; 5 1.6,-1.05; 6 1.6,1.05; 7 0.8,1.05; 8 0,1.05; 9 -0.8,1.05; 10 -1.6,1.05
R-PWSON-12 = smd 0.28 x 0.5: 1 -1.25,-0.95; 2 -0.75,-0.95; 3 -0.25,-0.95; 4 0.25,-0.95; 5 0.75,-0.95; 6 1.25,-0.95; 7 1.25,0.95; 8 0.75,0.95; 9 0.25,0.95; 10 -0.25,0.95; 11 -0.75,0.95; 12 -1.25,0.95 | smd 2.8 x 1: NC 0,0
QFN-48-6MM = smd 0.8 x 0.203: 1 -3,2.2; 2 -3,1.8; 3 -3,1.4; 4 -3,1; 5 -3,0.6; 6 -3,0.2; 7 -3,-0.2; 8 -3,-0.6; 9 -3,-1; 10 -3,-1.4; 11 -3,-1.8; 12 -3,-2.2; 25 3,-2.2; 26 3,-1.8; 27 3,-1.4; 28 3,-1; 29 3,-0.6; 30 3,-0.2; 31 3,0.2; 32 3,0.6; 33 3,1; 34 3,1.4; 35 3,1.8; 36 3,2.2 | smd 0.203 x 0.8: 13 -2.2,-3; 14 -1.8,-3; 15 -1.4,-3; 16 -1,-3; 17 -0.6,-3; 18 -0.2,-3; 19 0.2,-3; 20 0.6,-3; 21 1,-3; 22 1.4,-3; 23 1.8,-3; 24 2.2,-3; 37 2.2,3; 38 1.8,3; 39 1.4,3; 40 1,3; 41 0.6,3; 42 0.2,3; 43 -0.2,3; 44 -0.6,3; 45 -1,3; 46 -1.4,3; 47 -1.8,3; 48 -2.2,3 | smd 4.6 x 4.6: GND 0,0
SOT23-5 = smd 0.55 x 1.2: 1 -0.95,-1.3; 2 0,-1.3; 3 0.95,-1.3; 4 0.95,1.3; 5 -0.95,1.3
QFN-24-4MM2 = smd 1.016 x 0.254: 1 -2.066,1.257; 2 -2.066,0.75; 3 -2.066,0.247; 4 -2.066,-0.287; 5 -2.066,-0.792; 6 -2.066,-1.297; 13 2.086,-1.297; 14 2.086,-0.792; 15 2.086,-0.287; 16 2.086,0.247; 17 2.086,0.75; 18 2.086,1.257 | smd 0.254 x 1.016: 7 -1.267,-2.122; 8 -0.762,-2.122; 9 -0.258,-2.122; 10 0.278,-2.122; 11 0.78,-2.122; 12 1.287,-2.122; 19 1.287,2.082; 20 0.78,2.082; 21 0.278,2.082; 22 -0.258,2.082; 23 -0.762,2.082; 24 -1.267,2.082 | smd 2.616 x 2.616: P$1 0.02,-0.01
MOUNTINGHOLE_3.0_PLATEDTHIN = drill 3 pad 3.6: P$1 0,0
FA-128 = smd 0.95 x 0.85: 1 -0.725,-0.575; 2 0.725,-0.575; 3 0.725,0.575; 4 -0.725,0.575
ABS05 = smd 0.5 x 1: A -0.55,0; B 0.55,0

### Placement (x,y rotation side)
A1  5.75,62.28 270 top
B1  8.51,64.86 180 top
BT1  15.2,65.11 90 bottom
C1  7.69,66.08 90 top
C2  12.8,59.57 0 top
C3  9.86,59.1 0 top
C4  20.2,61.62 0 top
C5  20.24,59.69 0 top
C6  10.91,63.21 90 top
C7  14,60 270 top
C8  8.49,66.09 90 top
C9  18.32,75.54 180 top
C10  9.75,66.04 180 top
C11  20.69,62.75 270 top
C12  13.07,74.85 270 top
C13  10.2,63.21 90 top
C14  18.84,68.86 180 top
C15  7.29,72.84 90 bottom
C16  7.29,75.07 270 bottom
C17  20.13,38.99 270 top
C18  9.18,47.27 0 top
C19  17.71,38.99 270 top
C20  7.85,38.89 90 top
C21  12.37,44.05 90 top
C22  12.76,4.24 270 top
C23  14.43,13.92 0 top
C24  16.67,11.79 90 top
C25  8.08,6.32 180 top
D1  5.15,75.25 0 top
FB1  8.06,44.07 90 top
FB2  10.22,44.07 90 top
FID1  32.65,20.14 0 top
FID2  7.75,51.74 0 top
FID3  7.65,20.32 0 top
FRAME4  -13.41,-10.16 0 top  (outside the outline)
IC1  20,43.67 180 top
J1  7.1,68.07 180 top
J2  6.57,68.45 0 bottom
J3  21.8,67.4 0 top
JP1  20,17.78 0 top
JP2  4.48,14.53 270 top
JP3  22.89,12.7 270 top
JP4  2.57,12.7 270 top
JP5  22.89,3.81 270 top
JP6  1.3,1.27 0 top
L1  9.36,63.08 90 top
L2  5.77,74.51 90 bottom
L3  8.83,61.2 270 top
LOGO1  13.7,70.44 0 top
R1  5.2,73.51 90 top
R2  4.34,73.52 90 top
R3  6.01,73.51 90 top
R4  18.84,71.78 0 top
R5  20.42,73.79 270 top
R6  12.03,69.17 270 top
R7  22.41,35.56 270 top
R8  24.89,39.12 90 top
R9  16.8,34.64 0 top
R10  6.64,13.92 180 top
R11  6.64,12.4 180 top
S1  11.25,74.75 270 bottom
SJ1  19.08,8.89 270 top
SJ2  6.38,7.62 180 bottom
SJ3  19.08,7.62 0 bottom
U1  9.54,73.92 270 top
U2  20,28.19 0 top
U3  18.04,73.71 180 top
U4  9.35,73.95 90 bottom
U5  14.92,65.23 180 top
U6  10.77,38.89 0 top
U7  12.73,10.16 0 top
U$19  [LOGIC_5VREADY_5MM]  27.21,48.51 0 top
U$21  3,51.24 0 top
U$22  37,51.24 0 top
U$27  3,18.24 0 top
U$28  37,18.24 0 top
U$29  [ADAFRUIT_5MM]  27.42,36.11 0 top
U$30  12.73,7.62 180 bottom
U$31  -1.24,-13.97 0 top  (outside the outline)
U$32  [SFE-LOGO-FLAME]  17.81,13.97 180 bottom
U$33  [SFE-LOGO-FLAME]  16.87,14.43 270 top
U$34  [SFE-NEW-WEB]  5.11,13.97 180 bottom
X1  10.91,60.8 270 top
X2  20.14,60.64 0 top

### Tracks (layer width: path | path; a pad name or v marks a point on that pad's centre or on a via)
3.3V  (via drill 0.5)
  Top 0.254: IC1.P$7 19.25,41.54 C19.1 v16.29,40.01 | R7.1 22.26,36.73 v22.26,39.5
  Top 0.61: JP1.2 12.38,23.62 13.08,23.62 | 12.38,41.53 12.38,42.99 C21.1 | FB1.1 8.06,42.01 8.54,41.53 9.65,41.53 | 9.65,41.53 12.38,41.53 | U6.5 9.82,41.5 9.65,41.53 | U2.1 15.55,23.91 15.27,23.62 13.08,23.62 | 12.38,41.53 13.08,40.83 v13.08,39.88 13.08,23.62
  Bottom 0.254: v13.08,39.88 13.21,40.01 v16.29,40.01 21.75,40.01 v22.26,39.5
!FRAM_CS
  Top 0.152: 7.51,75.32 U1.1 8.07,75.83 10.57,75.83 10.8,75.59 10.8,72.17 11.04,71.96 11.6,71.96 13.92,69.5 U5.21
  Top 0.406: U1.1
!FRAM_HOLD
  Top 0.152: U5.20 14.32,72.14 12.09,74.37 11.47,74.37 11.52,74.37
  Top 0.406: 11.52,74.37 11.55,74.37 U1.7
!FRAM_WP
  Top 0.152: 7.51,73.42 8.23,72.79 8.23,72.24 8.44,72.03 10.19,72.03 10.6,71.63 11.46,71.63 13.52,69.44 U5.22
  Top 0.406: U1.3 7.51,73.45 7.51,73.42
!RTC_INT  (via drill 0.2)
  Top 0.152: U5.44 15.52,61.65 16.74,60.42 18.43,60.42 v18.75,60.15 | v17.59,71.76 17.24,72.02 U3.7
  Bottom 0.152: v17.59,71.76 17.66,71.91 20.27,71.91 20.8,71.38 20.8,61.45 19.5,60.15 v18.75,60.15
ADO  (via drill 0.51)
  Top 0.254: v16.67,8.13 17.05,8.13 17.81,8.89 SJ1.2 | U7.9 v12.47,6.48 v12.48,6.48
  Bottom 0.254: v12.48,6.48 13.88,6.48 15.53,8.13 v16.67,8.13
AGND
  Top 0.254: FB2.2 10.19,45.11 C18.2 10.22,47.24 11.46,47.24 12.61,48.39 17.3,48.39 17.75,47.94 IC1.P$10
AIN3  (via drill 0.2)
  Top 0.152: U5.6 20.03,65.03 v20.19,65.19
  Route2 0.152: J3.25B 20.05,75.65 20.05,75.15 21.11,74.09 21.11,65.78 20.52,65.19 v20.19,65.19
AIN4  (via drill 0.2)
  Top 0.152: U5.7 19.59,65.43 v20.2,65.96
  Route2 0.152: v20.2,65.96 20.75,66.51 20.75,73.95 J3.26
AIN5  (via drill 0.2)
  Top 0.152: U5.8 19.18,65.83 v19.34,65.99
  Route2 0.152: J3.27 19.13,74.57 19.59,74.57 20.43,73.73 20.43,66.74 20.17,66.51 19.86,66.51 v19.34,65.99
AIN6  (via drill 0.2)
  Top 0.152: v19.89,67.06 19.39,66.56 19.14,66.56 18.81,66.23 U5.9
  Bottom 0.152: J3.28 16.21,76.27 16.21,75.38 16.08,75.25 15.62,75.25 14.47,73.89 14.46,70.44 15.3,69.6 20.15,69.6 20.42,69.33 20.42,67.15 20.33,67.06 v19.89,67.06
AIN7  (via drill 0.2)
  Top 0.152: v19.87,67.84 19.32,67.31 18.64,66.63 U5.10
  Bottom 0.152: J3.29 15.24,76.3 15.24,75.45 14.09,73.99 14.08,70.37 15.16,69.29 19.59,69.29 19.87,69.01 v19.87,67.84
ANTENNA
  Top 0.254: B1.SE 8.09,64.9 7.95,64.86 | C1.1 7.69,64.86
  Top 0.5: A1.1 6.95,64.86 7.69,64.86 7.95,64.86
AUX_SCL
  Top 0.254: U7.7 11.46,7.42 11.21,7.16 4.66,7.16 3.82,6.33 3.82,1.3 JP6.2
AUX_SDA
  Top 0.254: JP6.1 1.3,7.62 2.54,8.86 U7.6
AVDD
  Top 0.254: FB1.2 8.16,45.18 C18.1 8.16,48.39 8.67,48.9 17.56,48.9 19.75,46.7 IC1.P$6
BATTERY  (1 unrouted)
  Bottom 0.152: U4.12 10.77,72.7 11,72.94 | BT1.POS 13.19,74.63 13.6,75.03 13.6,76.24 J3.31B
  Bottom 0.203: S1.B 11.23,73.76 11.43,73.56
  Bottom 0.406: BT1.POS 12.11,73.9 11.43,73.56 11,73.34 11,72.94 11,72.56 10.6,72.18 7.3,72.18 C15.1 7.02,71.91 7.02,71.25 6.07,70.29 J2.2
  pour Bottom (no thermals): 6.81,71.8 6.81,72.51 7.8,72.51 8.18,72.86 8.67,72.86 8.67,72.56 8.36,72.25 7.83,71.8
BOOTLOADER_CTRL  (via drill 0.2)
  Top 0.152: U5.19 14.69,68.25 14.69,70.72 v15,71.03
  Route15 0.152: v15,71.03 16.38,71.03 17.02,71.67 17.02,74.15 17.88,75.01 18.95,75.01 J3.24B
BOOTLOADER_RX  (via drill 0.2)
  Top 0.152: U5.17 15.53,69.97 v15.73,70.17
  Route15 0.152: J3.22 21.56,73.9 21.12,73.48 21.12,72.67 19.65,71.16 19.49,71 19.49,70.29 19.34,70.17 v15.73,70.17
BOOTLOADER_TX
  Top 0.152: J3.23B 21.62,74.9 21.13,74.34 21.13,72.66 19.3,70.83 19.3,70.54 19.16,70.39 16.4,70.39 16.09,70.71 16.07,70.71 15.45,70.71 15.12,70.28 U5.18
CLKIN  (via drill 0.51)
  Top 0.254: v7.65,10.41 9.43,10.41 9.81,10.8 9.81,11.18 10.04,11.41 10.65,11.41 U7.1
  Bottom 0.254: v7.65,10.41 6.89,9.65 SJ2.2 6.89,5.59 6.38,5.08 JP6.3
DISP
  Top 0.254: IC1.P$5 20.25,40.13 C17.1 21.24,40.01 21.24,36.7 20.63,36.1 U2.12
DISP_5V  (via drill 0.5)
  Top 0.254: U2.11 21.9,32.74 | 21.9,32.74 v21.88,32.67 | 21.9,32.74 22.41,33.25 R7.2
  Bottom 0.254: v21.88,32.67 21.88,26.67 22.26,26.29 26.45,26.29 27.59,25.15 27.59,17.81 JP1.8
EXTCOMIN
  Top 0.254: U2.10 23.17,31.91 23.53,32.26 23.53,41.15 23.27,41.4 21.11,41.4 20.75,41.77 IC1.P$4
EXTCOMIN_5V  (via drill 0.5)
  Top 0.254: U2.9 24.45,32.67 v24.54,32.77 24.42,32.89 24.42,37.34 24.89,37.82 R8.1
  Bottom 0.254: v24.54,32.77 24.54,27.31 25.05,26.8 28.61,26.8 30.13,25.27 30.13,17.81 JP1.9
EXTMODE
  Top 0.254: IC1.P$8 18.75,41.83 18.07,41.15 15.78,41.15 15.4,40.77 15.4,38.04 16.82,36.62 U2.15
EXTMODE_5V  (via drill 0.5)
  Top 0.254: U2.14 18.09,32.74 v18.07,32.77 17.81,33.02 R9.2
  Bottom 0.254: v18.07,32.77 18.07,26.8 19.08,25.78 24.16,25.78 25.05,24.89 25.05,17.81 JP1.7
FSYNC  (via drill 0.51)
  Top 0.254: U7.11 13.51,7.43 14.97,5.97 v15.53,5.97
  Bottom 0.254: JP6.7 16.54,5.59 16.16,5.97 | v15.53,5.97 16.16,5.97 | 16.16,5.97 17.81,7.62 SJ3.2
GND  (via drill 0.2, 0.5, 0.51)  (81 unrouted)
  Top 0.152: R4.2 19.75,71.78 20.42,72.44 R5.2 | U3.6 16.52,72.58 16.52,70.94 16.76,70.7 18.88,70.7 18.97,70.79 18.97,71.47 R4.2 | 19.13,71.82 R4.2 | C6.2 10.88,63.68 10.8,63.68 10.2,63.68 | 10.2,63.68 C13.2 | v12.37,61.45 12.31,61.52 X1.4 X1.2 10.34,59.14 C3.2 | C8.2 8.97,66.52 v9.29,66.82 | 10.2,63.68 10.2,64.1 10.06,64.24 8.81,64.24 v8.6,64.03 | C7.2 C2.2 13.26,59.61 v13.26,60.83
  Top 0.254: IC1.P$9 18.25,42.48 17.94,42.16 16.41,42.16 16.29,42.29 v16.29,43.31 | U7.18 15.69,11.42 15.7,11.43
  Top 0.406: U5.GND 15.54,65.23 v15.54,64.62
  Route2 0.406: J3.32 12.32,75.79 12.22,75.69
  Bottom 0.152: S1.A 11.57,75.63 J3.32
  Bottom 0.305: 9.6,74.2 U4.NC | 9.1,74.2 U4.NC | U4.11 9.67,73.2 9.35,73.52 U4.NC
  other vias: 15.3,72.42 21.24,59.01 19.84,62.36 11.47,70.23 17.67,68.64 14.27,75.08 13.04,67.12 14.24,67.12 16.74,67.12 15.54,67.12 15.54,65.82 14.24,63.42 13.04,63.42 14.24,64.62 13.04,64.62 14.24,65.82 13.05,65.83 16.74,65.82 16.74,64.62 16.74,63.42 15.54,63.42 9.88,71.35 9.5,74.48 25.69,36.45 17.68,36.45 10.68,36.22 16.62,13.92 17.81,5.08 24.16,8.89 10.19,3.18 7.65,3.2 5.11,3.18
  pour Top (no thermals): 3.86,76.41 21.78,76.35 21.8,58.42 8.02,58.44 8.03,64.53 8.83,64.54 8.86,64.17 12.08,64.24 12.08,62.22 18.04,62.25 18.05,68.2 12.34,68.19 12.29,65.41 8.04,65.44 8.04,66.12 7.32,66.09 6.89,66.09 6.89,66.06 3.84,66.11
  pour Bottom (no thermals): 8.92,76.42 12.63,76.38 12.63,75.56 20.99,75.56 21.11,59.13 11.59,59.23 11.59,58.42 8.01,58.44 8.01,66.14 6.89,66.1 6.89,66.06 3.84,66.11 3.84,76.4 4.86,76.44 4.86,71.54 9.43,71.54 9.43,75.22 8.92,75.22
  pour Route2 (no thermals): 3.86,76.41 11.94,76.34 11.97,76.89 12.66,76.89 12.7,76.35 21.77,76.34 21.78,58.43 7.99,58.45 8.02,66.1 6.9,66.11 6.9,66.07 6.9,66.06 3.84,66.11
  pour Bottom (no thermals): 6.79,74.36 9.43,74.36 9.43,73.52 6.79,73.52
  pour Top (isolate 0.254): 5.65,54.24 34.35,54.24 34.35,15.24 5.65,15.24
  pour Bottom (isolate 0.254): 34.35,54.24 5.65,54.24 5.65,15.24 34.35,15.24
  pour Top (isolate 0.305): 25.43,15.24 0.03,15.24 0.03,0 25.43,0
  pour Bottom (isolate 0.305): 25.43,15.24 0.03,15.24 0.03,0 25.43,0
I2C_SCL
  Top 0.152: U5.5 20.54,64.63 20.74,64.84 20.74,65.36 21.11,65.73 21.11,68.21 J3.17
I2C_SDA
  Top 0.152: J3.18 20.52,68.61 20.31,68.4 19.72,68.4 19.3,68.14 19.3,67.73 18.6,67.03 U5.11
INT
  Top 0.254: JP6.8 19.08,5.21 17.3,6.98 14.64,6.98 14.02,7.6 U7.12
LED_BLUE
  Top 0.152: 5.24,73.1 R1.1 5.24,70.35 5.38,70.21 8.62,70.21 10.95,67.88 10.95,66.91 11.23,66.63 U5.27
LED_GREEN  (via drill 0.2)
  Top 0.152: U5.28 11.01,66.23 v10.31,66.93 | R2.1 4.34,70.74 5.25,69.83 7.49,69.83 v7.83,69.49
  Bottom 0.152: v10.31,66.93 10.69,66.93 10.88,67.12 10.88,68.29 9.67,69.5 v7.84,69.5 v7.83,69.49
LED_RED
  Top 0.152: 6.02,73.11 R3.1 | R3.1 6.04,72.81 5.61,72.38 5.61,70.75 5.78,70.58 8.74,70.58 11.29,68.06 11.29,67.19 11.45,67.03 U5.26 | 6.04,73.11 R3.1
N$1
  Top 0.254: U7.20 13.51,13.92 C23.1
N$5  (1 unrouted)
  pour Bottom (no thermals): 8.67,73.34 8.18,73.34 7.8,73.04 6.43,73.04 6.43,73.85 5.11,73.8 5.11,73.32 5.59,73.32 6.18,72.73 7.75,72.73 8.13,73.04 8.67,73.04
N$6
  Top 0.152: 19.7,60.72 X2.A | 19.47,60.78 X2.A | C5.1 19.59,59.91 X2.A | U5.45 15.92,61.72 16.86,60.78 19.45,60.78 X2.A
N$7
  Top 0.152: 5.61,74.67 D1.2 5.74,74.66 5.74,74.18 R3.2
N$8
  Bottom 0.152: U4.8 11.21,74.7 S1.C
  Bottom 0.203: U4.8 U4.9
N$9
  Top 0.152: U5.37 12.7,62.24 10.49,62.24 10.36,62.11 10.36,61.45 X1.1 10.15,61.52 9.63,61 9.63,59.3 C3.1
N$10
  Top 0.152: U5.38 13.13,62.19 13.12,61.62 12.28,60.31 12.28,60.06 | 12.28,60.06 12.28,59.57 C2.1 | X1.3 12.28,60.06
N$11
  Top 0.152: R2.2 4.18,74.19 4.18,75.4 4.5,75.72 D1.4
N$12
  Top 0.152: 4.76,74.68 D1.3 5.2,74.33 R1.2
N$13
  Top 0.152: 19.7,61.71 C4.1 | U5.46 16.32,62.29 16.32,61.81 17.01,61.12 18.84,61.12 19.34,61.62 C4.1 | X2.B 19.77,61.56 C4.1
N$14
  Top 0.152: R4.1 18.84,72.33 U3.9
N$15
  Top 0.152: U5.29 10.29,65.83 C10.1
N$16
  Top 0.152: U3.1 19.88,74.76 R5.1
N$17
  Top 0.152: U5.39 13.52,61.4 14,60.8 C7.1
N$18
  Top 0.152: B1.ANT1 9.1,65.04 12.08,65.04 U5.31
N$19
  Top 0.152: U5.32 9.13,64.63 B1.ANT2
N$20
  Top 0.152: B1.VCC 8.45,65.59 C8.1 8.63,65.64 8.85,65.45 12.07,65.45 U5.30
N$21
  Top 0.254: C22.1 13.57,5.91 13.57,6.68 13.01,7.24 U7.10
N$36
  Top 0.152: U5.36 U5.35 11.56,63.43 C6.1 10.38,62.78 10.25,62.78 10.22,62.81 C13.1 10.13,62.71 9.37,62.71 9.36,62.68 L1.1
N$37
  Top 0.152: L1.2 8.95,63.52 8.7,63.29 8.7,62.18 L3.1
N$38  (via drill 0.2)
  Top 0.152: U5.2 18.73,63.43 v18.93,63.14 | v8.34,59.54 8.35,59.96 L3.2
  Route2 0.152: v18.93,63.14 18.93,62.37 19.11,62.11 19.11,61.21 18.91,61.01 16.81,61.01 16.53,60.73 16.53,59.61 16.22,59.29 8.57,59.3 v8.34,59.54
P08
  Top 0.152: J3.19 21.77,70.87 21.11,70.87 20.35,70.1 20.35,69.63 20.06,69.41 17.31,69.41 16.73,68.83 U5.14
P09
  Top 0.152: U5.15 16.32,69.09 16.96,69.73 19.88,69.73 20.03,69.88 20.03,70.27 21.66,71.9 J3.20
P10
  Top 0.152: U5.16 15.94,68.2 15.94,69.35 16.67,70.08 19.54,70.08 19.64,70.18 19.64,70.73 21.79,72.87 J3.21
P17  (via drill 0.2)
  Top 0.152: v9.59,70.56 9.59,70.26 11.92,67.93 U5.25
  Bottom 0.152: J3.2B 13.32,59.4 13.18,59.54 11.6,59.54 10.92,60.22 10.92,62.74 11.24,63.06 11.24,68.57 9.59,70.22 v9.59,70.56
P21
  Top 0.152: U5.40 13.93,61.39 16.22,59.1 16.64,59.1 J3.6
P22
  Top 0.152: U5.41 14.33,62.32 14.33,61.44 16.35,59.42 17.32,59.42 J3.7
P23
  Top 0.152: U5.42 14.72,62.32 14.72,61.54 16.53,59.73 17.73,59.73 18.35,59.11 18.63,59.11 J3.8B
P24
  Top 0.152: 20.32,58.71 J3.9B 20.32,58.72 20.01,59.03 19.59,59.03 19.2,59.42 18.6,59.42 17.97,60.05 16.65,60.05 15.11,61.59 15.11,62.35 U5.43
RTC_CE  (via drill 0.2)
  Top 0.152: U3.8 18.05,72.67 18.05,73.61 v18.22,73.78 | U5.47 16.72,62.26 16.72,61.86 16.99,61.59 17.69,61.59 v17.77,61.67
  Route2 0.152: v17.77,61.67 17.85,61.75 17.85,67.41 16.93,68.33 16.93,69.95 14.63,72.23 14.63,72.79 14.81,72.97 17.41,72.97 v18.22,73.78
SCL  (via drill 0.51)
  Top 0.254: U7.23 v11.97,13.72 | v11.97,13.72 | R10.1 11.77,13.92 v11.97,13.72
  Bottom 0.254: v11.97,13.72 10.55,12.29 10.55,5.54 14,2.08 JP6.6
SCLK
  Top 0.254: IC1.P$1 22.25,42.3 22.51,42.04 25.56,42.04 26.7,40.89 26.7,28.83 26.07,28.19 18.07,28.19 16.82,26.95 U2.2
SCLK_5V
  Top 0.254: U2.3 18.09,19.71 17.43,19.05 17.43,17.81 JP1.4
SCS
  Top 0.254: IC1.P$3 21.25,44.84 21.75,45.34 22.76,45.34 23.27,44.83 23.27,43.31 23.53,43.05 26.07,43.05 27.72,41.4 27.72,28.32 26.57,27.18 22.13,27.18 21.9,26.95 U2.6
SCS_5V
  Top 0.254: U2.7 23.17,19.84 22.64,19.3 22.64,17.88 JP1.6
SDA  (via drill 0.51)
  Top 0.254: U7.24 11.46,12.7 | 11.46,12.72 11.46,12.7 | 11.46,12.7 11.46,12.9 11.13,13.23 9.89,13.23 v8.92,12.27 | 8.9,12.24 v8.92,12.27 | R11.1 8.79,12.4 v8.92,12.27
  Bottom 0.254: v8.92,12.27 8.92,5.97 11.46,3.43 JP6.5
SI
  Top 0.254: IC1.P$2 21.75,44.58 22,44.83 22.51,44.83 22.76,44.58 22.76,42.8 23.02,42.55 25.81,42.55 27.21,41.15 27.21,28.58 26.32,27.69 19.97,27.69 19.36,27.08 U2.4
SI_5V
  Top 0.254: U2.5 20.63,19.59 19.97,18.92 19.97,17.81 JP1.5
SPI_MISO  (via drill 0.2)
  Top 0.152: U3.5 16.06,74.76 v15.7,74.5 | v6.25,71.92 6.25,72.09 6.55,72.39 6.56,73.51 7.57,74.38 7.57,74.37 7.51,74.37 | U5.48 17.27,62.23 17.27,62.4 18.02,62.4 v18.53,61.82
  Top 0.406: U1.2 7.57,74.39 7.57,74.38
  Route2 0.152: v6.25,71.92 10.17,71.91 11.74,73.48 12.84,73.48 13.85,74.49 15.46,74.5 v15.7,74.5 | v15.9,71.85 16.02,71.85 19.22,68.65 19.22,66.79 18.73,66.3 18.73,65.57 20.4,63.9 J3.14B
  Route15 0.152: v18.53,61.82 20.8,61.82 21.1,62.09 21.1,63.2 J3.14B | v15.7,74.5 16.22,73.98 16.22,72.17 v15.9,71.85
SPI_MOSI  (via drill 0.2)
  Top 0.152: 11.52,72.47 11.74,72.46 | 11.77,72.46 11.52,72.47 | v12.33,71.98 11.85,72.46 11.52,72.47 | U3.10 19.64,72.92 19.26,73.3 v19.26,73.97 | U5.3 19.33,63.83 v19.45,63.7
  Top 0.406: U1.5 11.52,72.5 11.52,72.47
  Route2 0.152: v12.33,71.98 12.33,72.1 14.37,74.15 15.11,74.15 15.45,73.94 16.66,73.94 17.28,74.56 18.66,74.56 v19.26,73.97
  Route15 0.152: v12.33,71.98 12.33,71.22 14.23,69.3 20.31,69.3 20.78,68.83 20.78,64.98 20.86,64.9 J3.15B 20.6,63.7 v19.45,63.7
SPI_SCK  (via drill 0.2)
  Top 0.152: 11.71,73.41 11.52,73.42 11.75,73.41 v13.28,71.97 | v15.07,73.52 15.11,73.52 15.53,73.94 17.16,73.94 17.29,74.09 17.29,74.7 U3.4 | U5.4 18.08,64.24 18.23,64.24 20.85,64.24 21.07,64.47 21.07,65.17 J3.16
  Top 0.406: 11.52,73.42 11.55,73.42 U1.6
  Route15 0.152: v15.07,73.52 13.28,71.99 v13.28,71.97 13.25,71.96 13.27,71.92 13.27,70.83 14.47,69.63 20.54,69.63 21.1,69.07 21.1,66.6 J3.16
SWDCLK  (via drill 0.2)
  Top 0.152: U5.24 12.72,68.61 12.7,68.62 12.19,68.62 R6.2 | R6.2 12.17,68.69 | v10.38,70.61 10.38,70.01 11.57,68.82 11.76,68.64 R6.2 | J1.4 v7.1,67.41 v7.11,67.4
  Route2 0.152: v7.11,67.4 6.8,67.4 6.49,67.7 6.49,69.74 6.83,70.08 8.72,70.08 9.06,69.74 10.17,69.74 10.38,69.95 v10.38,70.61
  Bottom 0.152: v10.38,70.61 10.38,69.95 11.59,68.74 11.59,62.88 11.39,62.68 11.39,60.32 11.83,59.88 13.54,59.88 14.13,59.29 15.12,59.29 15.33,59.08 J3.4
SWDIO/!RESET  (via drill 0.2)
  Top 0.152: U5.23 13.12,69.34 11.51,71.06 v11.07,71.06 | J1.2 v8.4,67.44
  Route2 0.152: v8.4,67.44 8.4,66.45 8.8,66.05 11.88,66.05 11.95,66.12 11.95,68.88 10.92,69.91 10.92,70.91 v11.07,71.06
  Route15 0.152: J3.3B 14.32,59.49 v14.73,59.83 | J3.30 13.02,75.08 13.02,73.97 12.82,73.77 11.26,73.77 11.07,73.58 v11.07,71.06
  Bottom 0.152: 11.09,71.04 v11.07,71.06 10.92,70.91 10.92,69.91 11.95,68.88 11.95,62.68 11.72,62.45 11.72,60.6 12.11,60.21 14.57,60.21 14.7,60.08 v14.73,59.83
VCC  (via drill 0.2)  (9 unrouted)
  Top 0.152: U3.2 18.85,74.77 18.85,75.49 C9.1 | C9.1 18.91,75.62 | C9.1 18.98,75.54 20.39,75.54 v20.71,75.32 | D1.1 5.94,75.68 6.33,75.29 v6.33,74.69 | 11.52,75.32 11.92,75.31 12.29,75.31 | 12.29,75.31 12.86,75.31 12.99,75.44 12.99,75.39 C12.1 | C11.1 20.61,63.1 20.51,63.13 v19.95,63.12 19.8,63.11 19.15,62.59 18.51,62.59 U5.1 | U5.12 18.13,67.43 v18.57,67.87 18.57,68.1 C14.1 | v12.34,74.86 12.34,75.29 12.29,75.31 | J1.1 v8.36,68.71
  Top 0.254: SJ1.1 20.81,9.7 24.16,6.35 JP6.10 | R11.2 R10.2 6.62,14.76 18.29,14.76 19.08,13.97 SJ1.1 | 16.39,10.66 C24.1 16.67,9.7 | U7.13 15.83,8.86 16.67,9.7 | 16.67,9.7 SJ1.1
  Top 0.406: 11.52,75.32 11.55,75.32 U1.8
  Route15 0.152: v8.36,68.71 J1.1
  Route15 0.508: J3.1B 12.32,59.19 12.3,59.21
  Bottom 0.406: v6.33,74.69 6.33,74.86 L2.2
  pour Route15 (no thermals): 3.84,75.69 21.11,75.69 21.14,64.89 21.14,64.75 21.11,59.11 12.68,59.11 12.68,57.91 11.97,57.91 11.97,59.11 8.02,59.1 7.99,66.12 6.88,66.11 6.89,66.03 6.89,66.06 3.84,66.11
  pour Bottom (no thermals): 8.67,74.54 8.01,74.54 7.68,75.12 5.08,75.12 5.08,76.16 7.83,76.16 7.83,75.53 8.13,74.87 8.67,74.87
VIN
  Top 0.61: JP1.1 9.84,33.75 7.94,35.65 7.94,37.78 | 7.94,37.78 C20.1 | 7.94,37.78 7.94,38 8.83,38.89 9.98,38.89 | 9.98,38.89 11.37,38.89 11.72,38.55 U6.3 | U6.1 9.82,38.73 9.98,38.89
VIO
  Top 0.254: JP6.4 C25.1 | 8.96,6.35 C25.1 | 9.14,6.53 C25.1 | U7.8 11.97,7.19 11.11,6.33 C25.1

### Text on the board
Bottom: V12
tPlace: NUCLEUM | Adafruit! | Sharp | Memory | Display | VIN (3.3-5V) | 3V3 | GND | SCLK | MOSI | CS | EXTMD | DISP | EXTIN | v1.1 | Z | Y | X | AD0 | FSYNC | ASDA | ASCL | CLK | VIO | SDA | SCL | INT | GND | VDD
bPlace: + | - | Rev_A | 2015/04/20 | Joshua Adkins | Adafruit Sharp Memory Disp | VIN | GND | DI | EMD | EIN | 3v3 | CLK | CS | DISP | MPU-6050 Breakout | CLK | SYNC | ASDA | ASCL | CLK | VIO | SDA | SCL | FSYNC | INT | GND | VDD
tValues: Joel Bartlett | Eric Orosel